# EAGLE design sabotter (EAGLE 6.5.0)
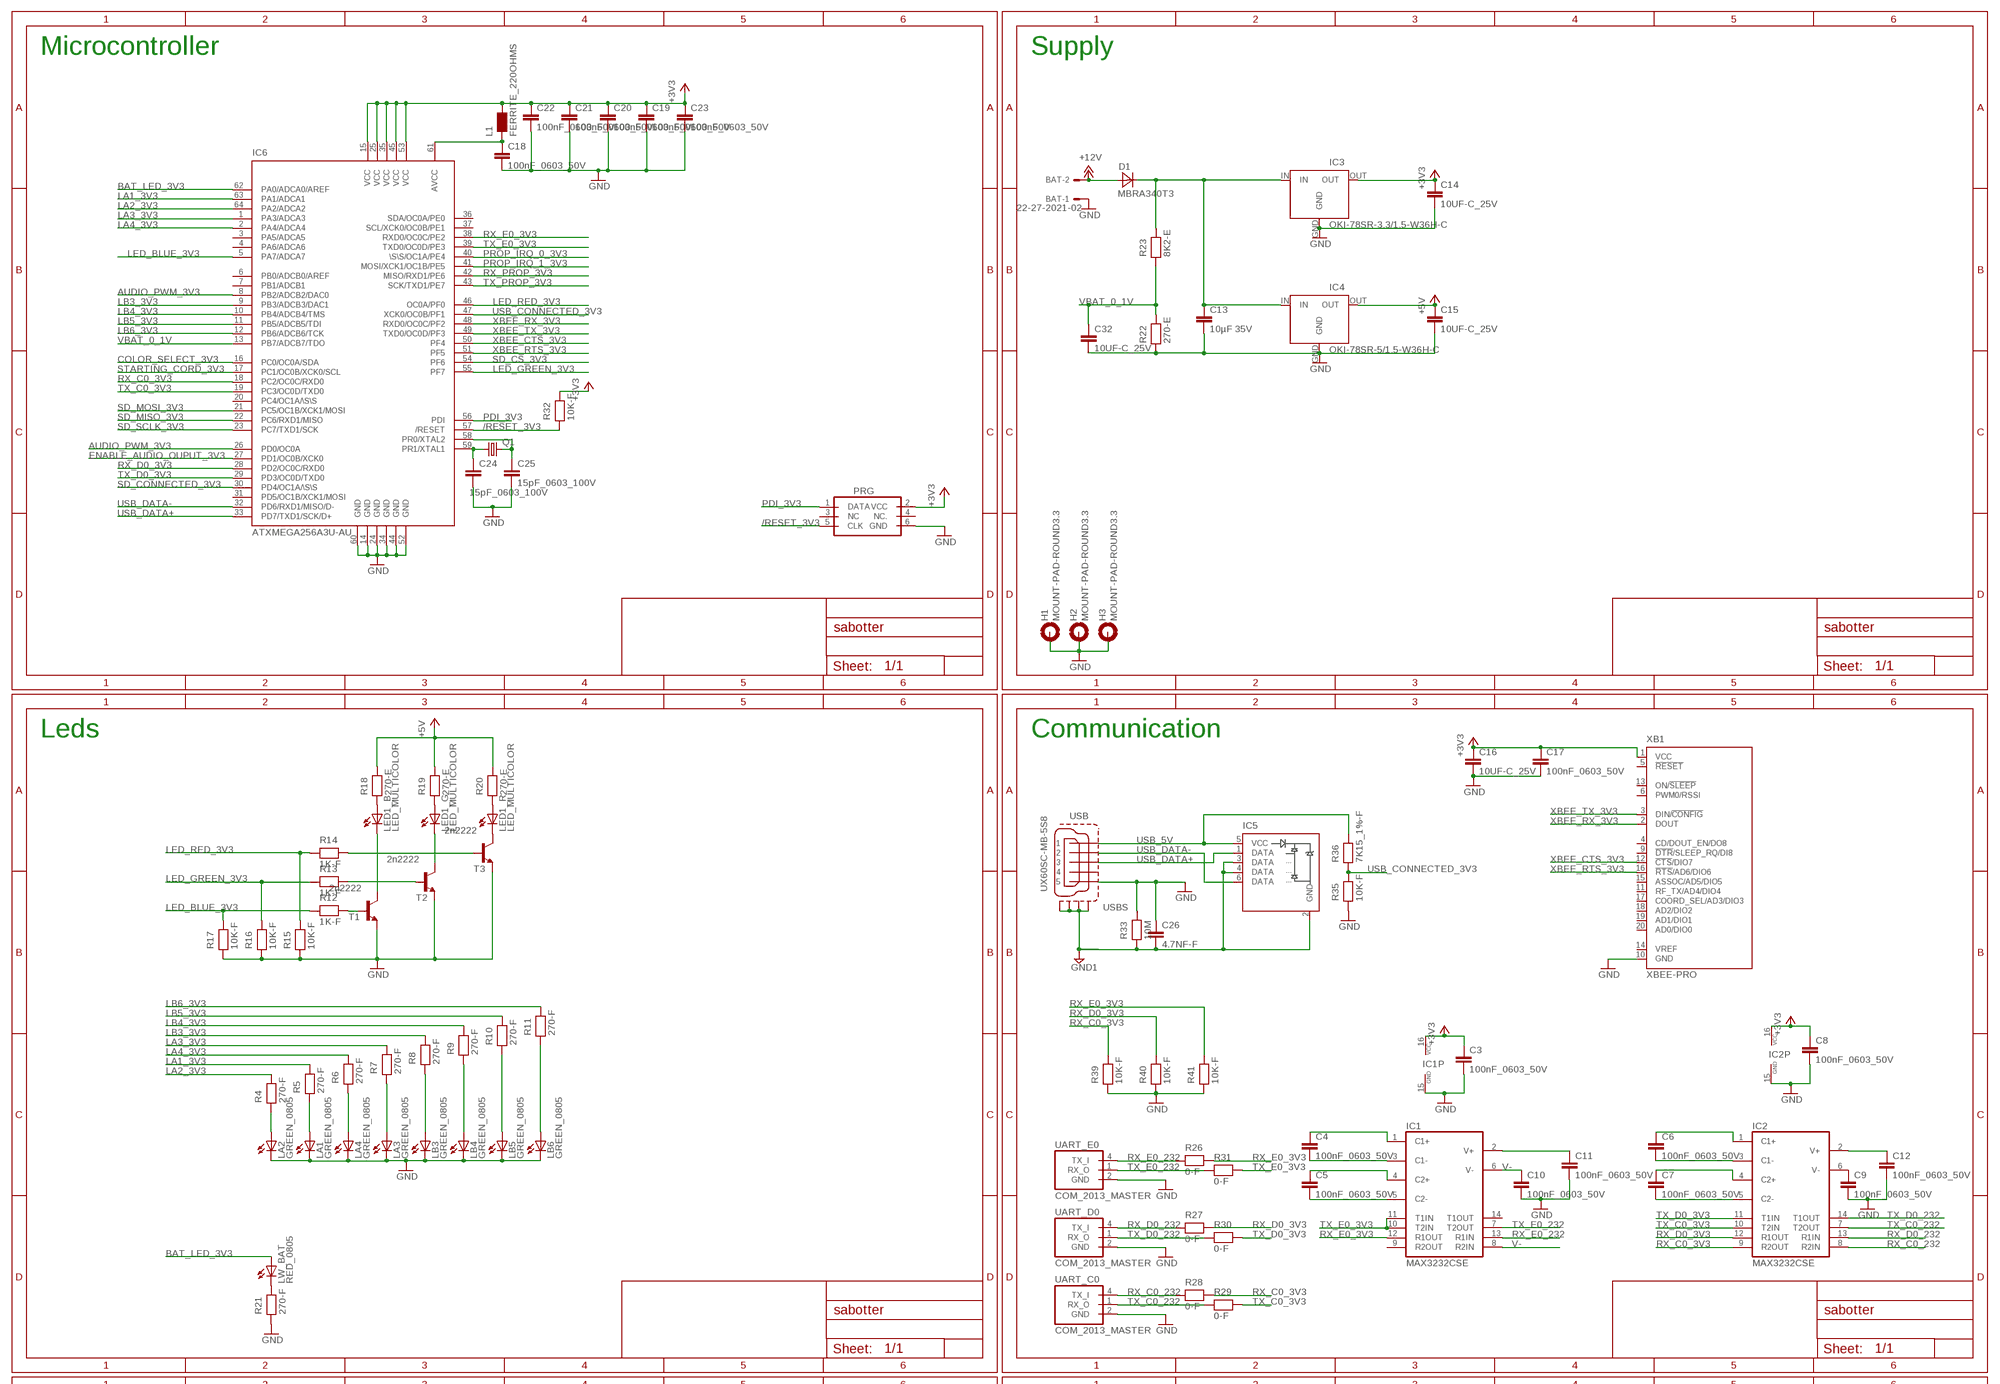
[diagram p0: schematic, sheet 1, part 1 of 2]
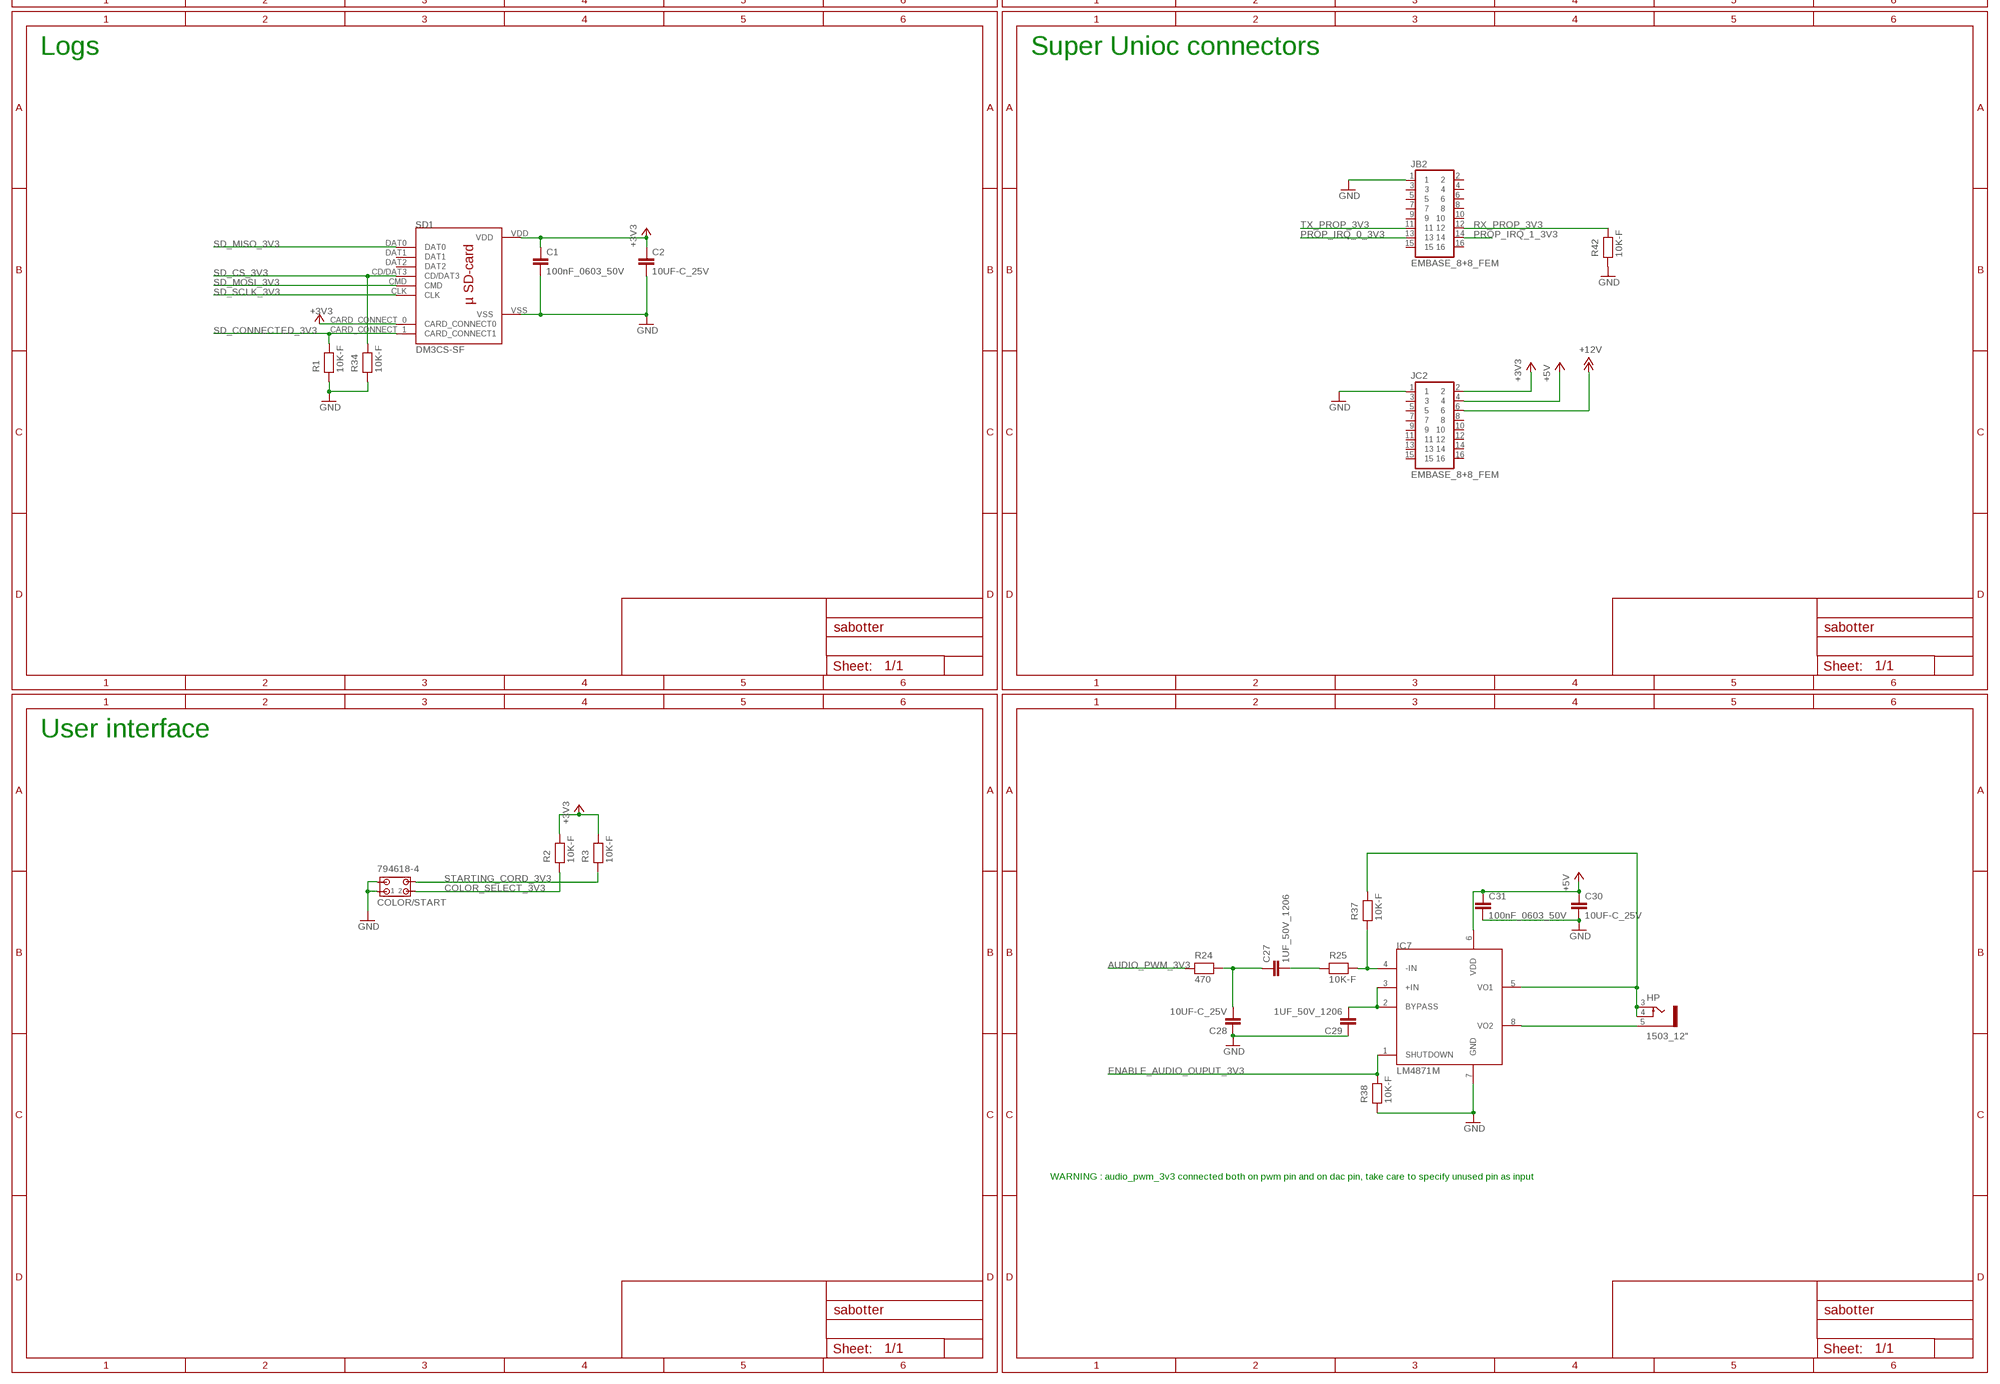
[diagram p1: schematic, sheet 1, part 2 of 2]

## Parts
BAT  22-27-2021-02  [6410-02]
C1  100nF_0603_50V  100NF-F  [C0603]
C2  10UF-C_25V  [C1210]
C3  100nF_0603_50V  100NF-F  [C0603]
C4  100nF_0603_50V  100NF-F  [C0603]
C5  100nF_0603_50V  100NF-F  [C0603]
C6  100nF_0603_50V  100NF-F  [C0603]
C7  100nF_0603_50V  100NF-F  [C0603]
C8  100nF_0603_50V  100NF-F  [C0603]
C9  100nF_0603_50V  100NF-F  [C0603]
C10  100nF_0603_50V  100NF-F  [C0603]
C11  100nF_0603_50V  100NF-F  [C0603]
C12  100nF_0603_50V  100NF-F  [C0603]
C13  10µF 35V  10UF-C_35V  [C1210]
C14  10UF-C_25V  [C1210]
C15  10UF-C_25V  [C1210]
C16  10UF-C_25V  [C1210]
C17  100nF_0603_50V  100NF-F  [C0603]
C18  100nF_0603_50V  100NF-F  [C0603]
C19  100nF_0603_50V  100NF-F  [C0603]
C20  100nF_0603_50V  100NF-F  [C0603]
C21  100nF_0603_50V  100NF-F  [C0603]
C22  100nF_0603_50V  100NF-F  [C0603]
C23  100nF_0603_50V  100NF-F  [C0603]
C24  15pF_0603_100V  15PF-F  [C0603]
C25  15pF_0603_100V  15PF-F  [C0603]
C26  4.7NF-F  [C0603]
C27  1UF_50V_1206  1UFD_25V  [C1206]
C28  10UF-C_25V  [C1210]
C29  1UF_50V_1206  1UFD_25V  [C1206]
C30  10UF-C_25V  [C1210]
C31  100nF_0603_50V  100NF-F  [C0603]
C32  10UF-C_25V  [C1210]
COLOR/START  794618-4  [794618-4]
D1  MBRA340T3  [SMA]
H1  MOUNT-PAD-ROUND3.3  [3,3-PAD]
H2  MOUNT-PAD-ROUND3.3  [3,3-PAD]
H3  MOUNT-PAD-ROUND3.3  [3,3-PAD]
HP  1503_12"  [1503_12]
IC1  MAX3232CSE  [SO16]
IC2  MAX3232CSE  [SO16]
IC3  OKI-78SR-3.3/1.5-W36H-C  [OKI78SR-HORIZONTAL]
IC4  OKI-78SR-5/1.5-W36H-C  [OKI78SR-HORIZONTAL]
IC5  LXES2SBAA4-016  [LXES2BAA4]
IC6  ATXMEGA256A3U-AU  [TQFP64]
IC7  LM4871M  [SO8]
JB2  EMBASE_8+8_FEM  [EMBASE_8+8_FEM]
JC2  EMBASE_8+8_FEM  [EMBASE_8+8_FEM]
L1  FERRITE_220OHMS  [R0603]
LA1  GREEN_0805  LED_G  [CHIP-LED0805]
LA2  GREEN_0805  LED_G  [CHIP-LED0805]
LA3  GREEN_0805  LED_G  [CHIP-LED0805]
LA4  GREEN_0805  LED_G  [CHIP-LED0805]
LB3  GREEN_0805  LED_G  [CHIP-LED0805]
LB4  GREEN_0805  LED_G  [CHIP-LED0805]
LB5  GREEN_0805  LED_G  [CHIP-LED0805]
LB6  GREEN_0805  LED_G  [CHIP-LED0805]
LED1  LED_MULTICOLOR  [PLCC6]
LW_BAT  RED_0805  LED_R  [CHIP-LED0805]
PRG  PDI_ATMELL  [ML6L]
Q1  CRYSTAL_16MHZ_HC49UP  [HC49UP]
R1  10K-F  [R0603]
R2  10K-F  [R0603]
R3  10K-F  [R0603]
R4  270-F  [R0603]
R5  270-F  [R0603]
R6  270-F  [R0603]
R7  270-F  [R0603]
R8  270-F  [R0603]
R9  270-F  [R0603]
R10  270-F  [R0603]
R11  270-F  [R0603]
R12  1K-F  [R0603]
R13  1K-F  [R0603]
R14  1K-F  [R0603]
R15  10K-F  [R0603]
R16  10K-F  [R0603]
R17  10K-F  [R0603]
R18  270-E  [R0805]
R19  270-E  [R0805]
R20  270-E  [R0805]
R21  270-F  [R0603]
R22  270-E  [R0805]
R23  8K2-E  [R0805]
R24  470  470-F  [R0603]
R25  10K-F  [R0603]
R26  0-F  [R0603]
R27  0-F  [R0603]
R28  0-F  [R0603]
R29  0-F  [R0603]
R30  0-F  [R0603]
R31  0-F  [R0603]
R32  10K-F  [R0603]
R33  10M  1M-F  [R0603]
R34  10K-F  [R0603]
R35  10K-F  [R0603]
R36  7K15_1%-F  [R0603]
R37  10K-F  [R0603]
R38  10K-F  [R0603]
R39  10K-F  [R0603]
R40  10K-F  [R0603]
R41  10K-F  [R0603]
R42  10K-F  [R0603]
SD1  DM3CS-SF  [DM3CS-SF]
T1  2n2222  MMBT2222ALT1-NPN-SOT23-BEC  [SOT23-BEC]
T2  2n2222  MMBT2222ALT1-NPN-SOT23-BEC  [SOT23-BEC]
T3  2n2222  MMBT2222ALT1-NPN-SOT23-BEC  [SOT23-BEC]
UART_C0  COM_2013_MASTER  [MICROMATCH-4_SMD]
UART_D0  COM_2013_MASTER  [MICROMATCH-4_SMD]
UART_E0  COM_2013_MASTER  [MICROMATCH-4_SMD]
USB  UX60SC-MB-5S8  MINI-USB-SHIELD-UX60-MB-5S8  [UX60-MB-5S8]
XB1  XBEE-PRO  [XBEE-PRO]

## Nets
+3V3: C1.1 C2.1 C3.1 C8.1 C14.1 C16.1 C17.1 C19.1 C20.1 C21.1 C22.1 C23.1 IC1.16(VCC) IC2.16(VCC) IC3.OUT IC6.15(VCC) IC6.25(VCC) IC6.35(VCC) IC6.45(VCC) IC6.53(VCC) JC2.2 L1.2 PRG.2(VCC) R2.2 R3.2 R32.2 SD1.CARD_CONNECT_0(CARD_CONNECT0) SD1.VDD XB1.1(VCC)
+5V: C15.1 C30.1 C31.1 IC4.OUT IC7.6(VDD) JC2.4 R18.2 R19.2 R20.2
+12V: BAT.2 D1.A JC2.6
/RESET_3V3: IC6.57(/RESET) PRG.5(CLK) R32.1
AUDIO_PWM_3V3: IC6.8(PB2/ADCB2/DAC0) IC6.26(PD0/OC0A) R24.1
BAT_LED_3V3: IC6.62(PA0/ADCA0/AREF) LW_BAT.A
COLOR_SELECT_3V3: COLOR/START.2 IC6.16(PC0/OC0A/SDA) R2.1
ENABLE_AUDIO_OUPUT_3V3: IC6.27(PD1/OC0B/XCK0) IC7.1(SHUTDOWN) R38.2
GND: BAT.1 C1.2 C2.2 C3.2 C8.2 C9.2 C10.2 C11.2 C12.2 C13.2 C14.2 C15.2 C16.2 C17.2 C18.2 C19.2 C20.2 C21.2 C22.2 C23.2 C24.2 C25.2 C26.1 C28.1 C29.1 C30.2 C31.2 C32.2 COLOR/START.1 COLOR/START.3 H1.B3,3(MOUNT) H2.B3,3(MOUNT) H3.B3,3(MOUNT) IC1.15(GND) IC2.15(GND) IC3.GND IC4.GND IC6.14(GND) IC6.24(GND) IC6.34(GND) IC6.44(GND) IC6.52(GND) IC6.60(GND) IC7.7(GND) JB2.1 JC2.1 LA1.C LA2.C LA3.C LA4.C LB3.C LB4.C LB5.C LB6.C PRG.6(GND) R1.1 R15.1 R16.1 R17.1 R21.1 R22.1 R33.2 R34.1 R35.1 R38.1 R39.1 R40.1 R41.1 R42.1 SD1.VSS T1.E T2.E T3.E UART_C0.2(GND) UART_D0.2(GND) UART_E0.2(GND) USB.5 XB1.10(GND)
GND1: C26.2 IC5.2(GND) IC5.3(DATA) IC5.4(DATA) R33.1 USB.M1(S1) USB.M2(S2) USB.M3(S3) USB.M4(S4)
LA1_3V3: IC6.63(PA1/ADCA1) R5.2
LA2_3V3: IC6.64(PA2/ADCA2) R4.2
LA3_3V3: IC6.1(PA3/ADCA3) R7.2
LA4_3V3: IC6.2(PA4/ADCA4) R6.2
LB3_3V3: IC6.9(PB3/ADCB3/DAC1) R8.2
LB4_3V3: IC6.10(PB4/ADCB4/TMS) R9.2
LB5_3V3: IC6.11(PB5/ADCB5/TDI) R10.2
LB6_3V3: IC6.12(PB6/ADCB6/TCK) R11.2
LED_BLUE_3V3: IC6.5(PA7/ADCA7) R12.1 R17.2
LED_GREEN_3V3: IC6.55(PF7) R13.1 R16.2
LED_RED_3V3: IC6.46(OC0A/PF0) R14.1 R15.2
N$1: LA2.A R4.1
N$2: LA1.A R5.1
N$3: LB3.A R8.1
N$4: LA3.A R7.1
N$5: LB4.A R9.1
N$6: LB5.A R10.1
N$7: LB6.A R11.1
N$8: LA4.A R6.1
N$9: HP.5 IC7.8(VO2)
N$15: C29.2 IC7.2(BYPASS) IC7.3(+IN)
N$18: C9.1 IC2.6(V-)
N$20: C27.1 C28.2 R24.2
N$22: LED1.3(_R:C) T3.C
N$23: LED1.2(_G:C) T2.C
N$24: LED1.1(_B:C) T1.C
N$25: C12.1 IC2.2(V+)
N$26: C11.1 IC1.2(V+)
N$27: R14.2 T3.B
N$28: C4.1 IC1.1(C1+)
N$29: C6.1 IC2.1(C1+)
N$30: C5.1 IC1.4(C2+)
N$31: C5.2 IC1.5(C2-)
N$32: C4.2 IC1.3(C1-)
N$33: C6.2 IC2.3(C1-)
N$34: C7.1 IC2.4(C2+)
N$35: C7.2 IC2.5(C2-)
N$36: C27.2 R25.1
N$37: IC7.4(-IN) R25.2 R37.1
N$38: HP.3 HP.4 IC7.5(VO1) R37.2
N$52: R13.2 T2.B
N$53: R12.2 T1.B
N$57: LED1.6(_B:A) R18.1
N$58: LED1.5(_G:A) R19.1
N$59: LED1.4(_R:A) R20.1
N$60: LW_BAT.C R21.2
N$62: C13.1 D1.C IC3.IN IC4.IN R23.2
N$71: C18.1 IC6.61(AVCC) L1.1
N$75: C24.1 IC6.59(PR1/XTAL1) Q1.1
N$76: C25.1 IC6.58(PR0/XTAL2) Q1.2
PDI_3V3: IC6.56(PDI) PRG.1(DATA)
PROP_IRQ_0_3V3: IC6.40(\S\S/OC1A/PE4) JB2.13
PROP_IRQ_1_3V3: IC6.41(MOSI/XCK1/OC1B/PE5) JB2.14
RX_C0_3V3: IC2.9(R2OUT) IC6.18(PC2/OC0C/RXD0) R28.2 R39.2
RX_C0_232: IC2.8(R2IN) R28.1 UART_C0.4(TX_I)
RX_D0_3V3: IC2.12(R1OUT) IC6.28(PD2/OC0C/RXD0) R27.2 R40.2
RX_D0_232: IC2.13(R1IN) R27.1 UART_D0.4(TX_I)
RX_E0_3V3: IC1.12(R1OUT) IC6.38(RXD0/OC0C/PE2) R26.2 R41.2
RX_E0_232: IC1.13(R1IN) R26.1 UART_E0.4(TX_I)
RX_PROP_3V3: IC6.42(MISO/RXD1/PE6) JB2.12 R42.2
SD_CONNECTED_3V3: IC6.30(PD4/OC1A/\S\S) R1.2 SD1.CARD_CONNECT_1(CARD_CONNECT1)
SD_CS_3V3: IC6.54(PF6) R34.2 SD1.CD/DAT3
SD_MISO_3V3: IC6.22(PC6/RXD1/MISO) SD1.DAT0
SD_MOSI_3V3: IC6.21(PC5/OC1B/XCK1/MOSI) SD1.CMD
SD_SCLK_3V3: IC6.23(PC7/TXD1/SCK) SD1.CLK
STARTING_CORD_3V3: COLOR/START.4 IC6.17(PC1/OC0B/XCK0/SCL) R3.1
TX_C0_3V3: IC2.10(T2IN) IC6.19(PC3/OC0D/TXD0) R29.2
TX_C0_232: IC2.7(T2OUT) R29.1 UART_C0.1(RX_O)
TX_D0_3V3: IC2.11(T1IN) IC6.29(PD3/OC0D/TXD0) R30.2
TX_D0_232: IC2.14(T1OUT) R30.1 UART_D0.1(RX_O)
TX_E0_3V3: IC1.10(T2IN) IC1.11(T1IN) IC6.39(TXD0/OC0D/PE3) R31.2
TX_E0_232: IC1.7(T2OUT) R31.1 UART_E0.1(RX_O)
TX_PROP_3V3: IC6.43(SCK/TXD1/PE7) JB2.11
USB_5V: IC5.5(VCC) R36.2 USB.1
USB_CONNECTED_3V3: IC6.47(XCK0/OC0B/PF1) R35.2 R36.1
USB_DATA+: IC5.1(DATA) IC6.33(PD7/TXD1/SCK/D+) USB.3
USB_DATA-: IC5.6(DATA) IC6.32(PD6/RXD1/MISO/D-) USB.2
V-: C10.1 IC1.6(V-) IC1.8(R2IN)
VBAT_0_1V: C32.1 IC6.13(PB7/ADCB7/TDO) R22.2 R23.1
XBEE_CTS_3V3: IC6.50(PF4) XB1.12(!CTS!/DIO7)
XBEE_RTS_3V3: IC6.51(PF5) XB1.16(!RTS!/AD6/DIO6)
XBEE_RX_3V3: IC6.48(RXD0/OC0C/PF2) XB1.2(DOUT)
XBEE_TX_3V3: IC6.49(TXD0/OC0D/PF3) XB1.3(DIN/!CONFIG)
Unconnected: IC1.9(R2OUT) IC1.14(T1OUT) IC6.3(PA5/ADCA5) IC6.4(PA6/ADCA6) IC6.6(PB0/ADCB0/AREF) IC6.7(PB1/ADCB1) IC6.20(PC4/OC1A/\S\S) IC6.31(PD5/OC1B/XCK1/MOSI) IC6.36(SDA/OC0A/PE0) IC6.37(SCL/XCK0/OC0B/PE1) JB2.2 JB2.3 JB2.4 JB2.5 JB2.6 JB2.7 JB2.8 JB2.9 JB2.10 JB2.15 JB2.16 JC2.3 JC2.5 JC2.7 JC2.8 JC2.9 JC2.10 JC2.11 JC2.12 JC2.13 JC2.14 JC2.15 JC2.16 PRG.3(NC) PRG.4(NC.) SD1.DAT1 SD1.DAT2 USB.4 XB1.4(CD/DOUT_EN/DO8) XB1.5(!RESET) XB1.6(PWM0/RSSI) XB1.9(!DTR!/SLEEP_RQ/DI8) XB1.11(RF_TX/AD4/DIO4) XB1.13(ON/!SLEEP) XB1.14(VREF) XB1.15(ASSOC/AD5/DIO5) XB1.17(COORD_SEL/AD3/DIO3) XB1.18(AD2/DIO2) XB1.19(AD1/DIO1) XB1.20(AD0/DIO0)

## Notes on the sheet
- Microcontroller | Supply
- Leds | Communication
- Logs | Super Unioc connectors
- User interface
- WARNING : audio_pwm_3v3 connected both on pwm pin and on dac pin, take care to specify unused pin as input

## Library data of the parts
BAT = robotter_connector:22-?-02: CONNECTOR wire to board 2.54 mm (.1 inch) pitch header; MOUSER: 538-22-27-2021; RS: 483-8461
C1 C3-C12 C17-C23 C31 = robotter_capacitor:100NF; MOUSER: 81-GRM188F51H104ZA01; RS: 723-5534; VALUE: 100nF 50V
C2 C14-C16 C28 C30 C32 = robotter_capacitor:10UF; MOUSER: 963-TMK316BJ106KL-T; RS: 766-1185; VALUE: 10µF 25V
C13 = robotter_capacitor:10UF; MOUSER: 963-GMK325BJ106MN-T; RS: 758-3325
C24 C25 = robotter_capacitor:15PF; MOUSER: 581-06031A150K4T2A; RS: 147-421
C26 = robotter_capacitor:4.7NF; MOUSER: 81-GCM188R71H472K37D; RS: 723-5004; VALUE: 4.7nF 50V
C27 C29 = robotter_capacitor:1UF; MOUSER: 810-C3216X7R1E105K-6; RS: 740-7574; VALUE: 1µF 25V
COLOR/START = robotter_connector:794618-4; MOUSER: 571-3-794618-4; RS: 495-9439
D1 = robotter_diode:MBRA340T3: Surface Mount Schottky Power Rectifier Source: http://www.onsemi.com/pub_link/Collateral/MBRA340T3-D.PDF; MOUSER: 863-MBRA340T3G; RS: 688-0502
H1-H3 = holes:MOUNT-PAD-ROUND: MOUNTING PAD, round
HP = robotter_connector:1503_12: Jack connectors according to JISC 6560, 2.5mm / 3.5 mm Klinkensteckverbinder nach JISC 6560, 2.5mm / 3,5 mm Source: http://www.lumberg.com/Produkte/PDFs/KLBR2.pdf www.lumberg.com/Produkte/PDFs/KLBR1.pdf; FARNELL: 1340604; MPN: 1503 12; RS: 413-453; VALUE: 1503 12
IC1 IC2 = robotter_ic:MAX3232: True RS-232 Transceivers 3.0V to 5.5V, Low-Power up to 1Mbps, Using Four 0.1µF External Capacitors Source: http://pdfserv.maxim-ic.com/en/ds/MAX3222-MAX3241.pdf; MOUSER: 511-ST3232CDR; RS: 415-2105
IC3 = robotter_ic:OKI-78SR: 1.5A, 7-36V DC regulator; MOUSER: 580-OKI78SR3.31.5WHC
IC4 = robotter_ic:OKI-78SR: 1.5A, 7-36V DC regulator; MOUSER: 580-OKI78SR51.5W36HC
IC5 = robotter_ic:LXES2SBAA4-016; MOUSER: 81-LXES2SBAA4-016
IC6 = robotter_ic:ATXMEGA256A3U; FARNELL: 2066307; MOUSER: 556-ATXMEGA256A3U-AU
IC7 = robotter_ic:LM4871; MOUSER: 926-LM4871MX/NOPB; RS: 533-8271
JB2 JC2 = robotter_connector:EMBASE_8+8_FEM; FARNELL: 1109794; MOUSER: 855-M22-7140842; RS: 605-8847
L1 = robotter_inductor:FERRITE_220OHMS; MOUSER: 81-BLM18BB221SN1D; RS: 724-1302; VALUE: 220 ohms
LA1-LA4 LB3-LB6 = robotter_diode:LED_; MOUSER: 859-LTST-C171GKT; RS: 692-0935; VALUE: GREEN
LED1 = robotter_diode:LED_MULTICOLOR; FARNELL: 1863245; MANUFACTURER: AVAGO TECHNOLOGIES; MOUSER: 630-ASMT-YTD2-0BB02; RS: 769-3520; VALUE: ASMT-YTD2-0BB02
LW_BAT = robotter_diode:LED_; MOUSER: 859-LTST-C171EKT; RS: 692-0931; VALUE: RED
PRG = robotter_connector:PDI_ATMEL: Ref Harting : 09 18 506 7323 Atmel pdi connector; MOUSER: 617-09-18-506-7323; RS: 693-5242
Q1 = robotter_ic:CRYSTAL_: CRYSTAL; MOUSER: 559-FOXSD160-20-LF; RS: 547-6531; VALUE: 16 MHz
R1-R3 R15-R17 R25 R32 R34 R35 R37-R42 = robotter_resistor:10K; MOUSER: 652-CR0603-JW-103ELF; RS: 740-8899
R4-R11 R21 = robotter_resistor:270; MOUSER: 71-CRCW0603J-270-E3; RS: 679-0071
R12-R14 = robotter_resistor:1K; MOUSER: 71-CRCW0603-1.0K-E3; RS: 213-2266; VALUE: 1k
R18-R20 R22 = robotter_resistor:270; MOUSER: 652-CR0805-FX2700GLF; RS: 740-9019
R23 = robotter_resistor:8K2; MOUSER: 71-CRCW08058K20FKEB; RS: 679-1727
R24 = robotter_resistor:470; MOUSER: 279-CRG0603F470R; RS: 213-2222
R26-R31 = robotter_resistor:0
R33 = robotter_resistor:1M
R36 = robotter_resistor:7K15_1%; MOUSER: 71-CRCW0603-7.15K-E3; RS: 679-0709
SD1 = robotter_connector:DM3CS-SF; MOUSER: 798-DM3CSSF; RS: 772-6787
T1-T3 = robotter_ic:*-NPN-: NPN Transistror; MOUSER: 863-MMBT2222ALT1G; RS: 544-9400; VALUE: mmbt2222
UART_C0 UART_D0 UART_E0 = robotter_connector:COM_2013_MASTER; MOUSER: 571-7-188275-4; RS: 366-1721
USB = robotter_connector:MINI-USB-SHIELD-: MINI USB Connector Source: http://www.hirose.co.jp/cataloge_hp/e24000019.pdf; MOUSER: 798-UX60SCMB5S880; OC_FARNELL: unknown; OC_NEWARK: unknown; RS: 772-6926
XB1 = maxstream:XBEE: XBee (TM) /XBee-PRO(TM) OEM RF Modules Source: MaxStream, Inc. xbee_productmanual.pdf; MPN: XBP24-AWI-001; OC_FARNELL: 1337916; OC_NEWARK: 42M2667

## Board
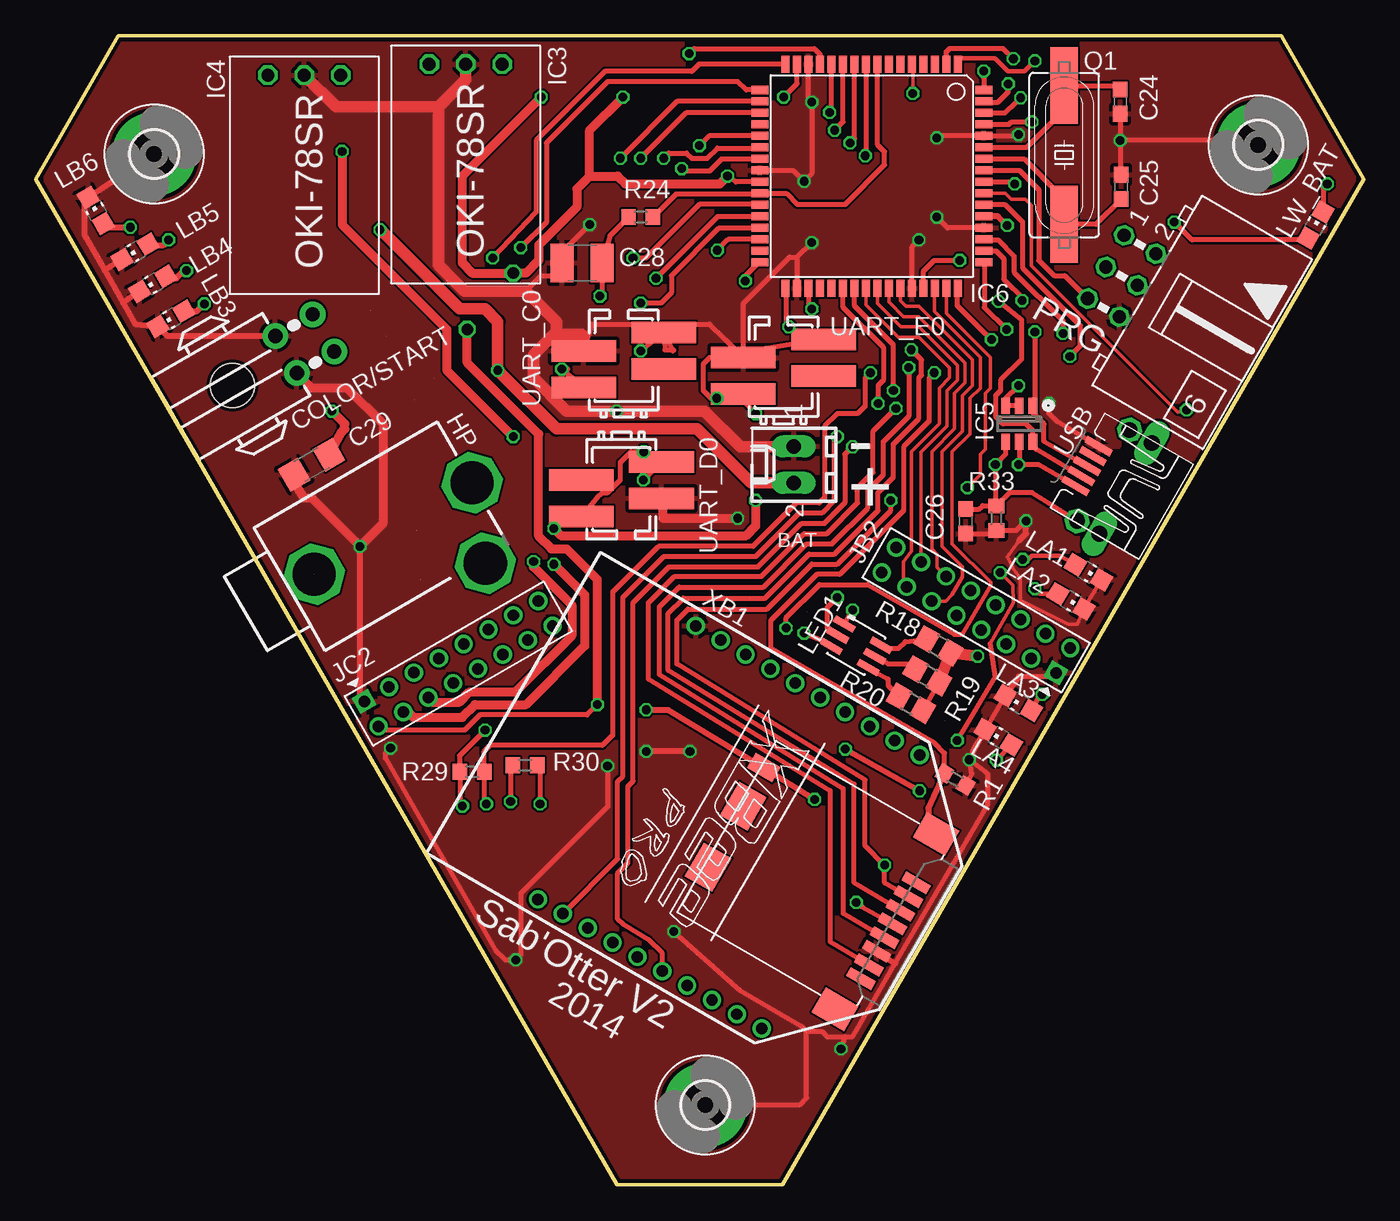
[diagram p2: board, top side]
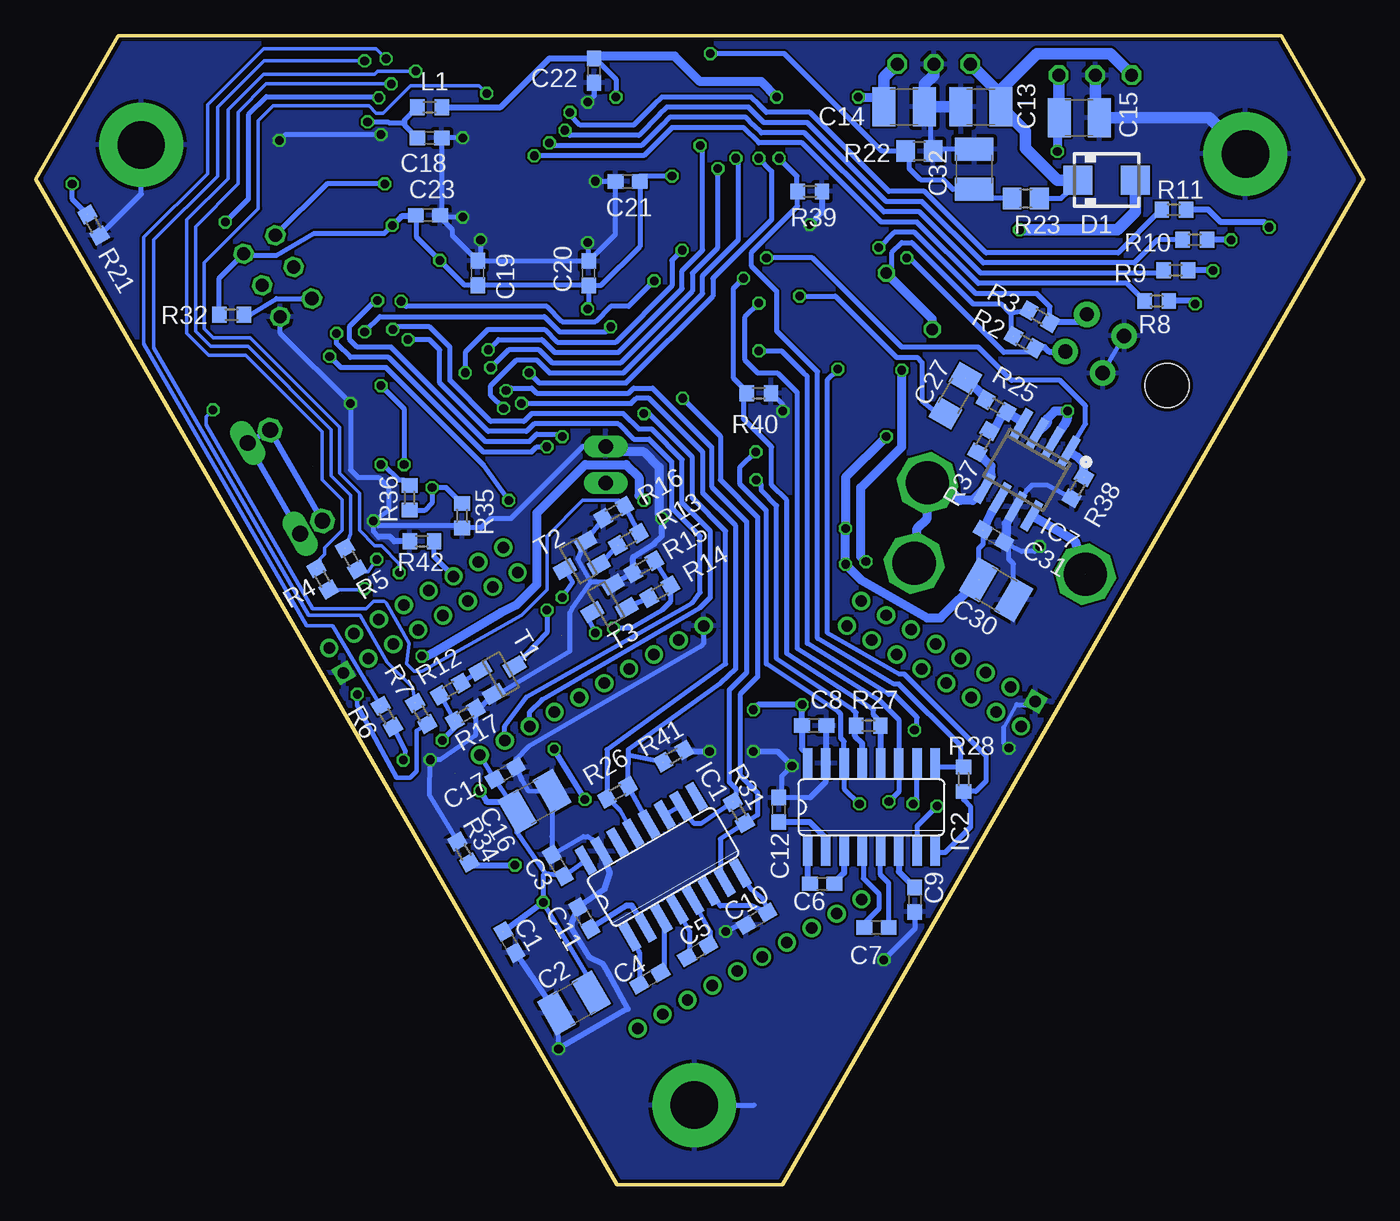
[diagram p3: board, bottom side, seen from below]

Size 92.5 x 80 mm. Coordinates in mm from the lower left corner, seen from the top.
Outline: 5.75,80 86.75,80 92.5,70 52,0 40.5,0 0,70 5.75,80
Copper layers (1*16): Top 0.035mm / dielectric 1.6mm / Bottom 0.035mm
Design rules "SeeedStudio_DRU_no_angle_20130527 *": minimum track width 6mil, minimum drill 12mil, track to track 6mil, track to pad 6mil, pad to pad 6mil, via to via 6mil, smd to smd 0mil, copper to edge 10mil, drill to drill 10mil, minimum pad ring 6mil, minimum via ring 6mil, stop-mask expansion 2mil, vias tented up to drill 25mil, thermal gap 10mil

### Footprints (pad centres in the part's own frame; a part is rotated, then mirrored left to right if it is on the bottom)
6410-02 = drill 1.016 long: 1 1.27,0; 2 -1.27,0
C0603 = smd 1.1 x 1: 1 -0.85,0; 2 0.85,0
C1210 = smd 1.6 x 2.7: 1 -1.4,0; 2 1.4,0
C1206 = smd 1.6 x 1.8: 1 -1.4,0; 2 1.4,0
794618-4 = drill 1 pad 1.778: 1 1.5,4.32; 2 1.5,7.32; 3 -1.5,4.32; 4 -1.5,7.32 | hole 3.1: 0,0
SMA = smd 2 x 2: A 2,0; C -2,0
3,3-PAD = drill 3.3 pad 5.842: B3,3 0,0
1503_12 = drill 3 pad 4 octagon: 3 0,-6.35; 4 -5.3,-4.35; 5 0,6.35
SO16 = smd 0.66 x 2.032: 1 -4.445,-3.073; 2 -3.175,-3.073; 3 -1.905,-3.073; 4 -0.635,-3.073; 5 0.635,-3.073; 6 1.905,-3.073; 7 3.175,-3.073; 8 4.445,-3.073; 9 4.445,3.073; 10 3.175,3.073; 11 1.905,3.073; 12 0.635,3.073; 13 -0.635,3.073; 14 -1.905,3.073; 15 -3.175,3.073; 16 -4.445,3.073
OKI78SR-HORIZONTAL = drill 0.9 octagon: GND 0,0; IN 2.54,0; OUT -2.54,0
LXES2BAA4 = smd 0.6 x 1.1: 1 -0.95,-1.25; 2 0,-1.25; 3 0.95,-1.25; 4 0.95,1.25; 5 0,1.25; 6 -0.95,1.25
TQFP64 = smd 1.194 x 0.559: 1 -7.8,6; 2 -7.8,5.2; 3 -7.8,4.4; 4 -7.8,3.6; 5 -7.8,2.8; 6 -7.8,2; 7 -7.8,1.2; 8 -7.8,0.4; 9 -7.8,-0.4; 10 -7.8,-1.2; 11 -7.8,-2; 12 -7.8,-2.8; 13 -7.8,-3.6; 14 -7.8,-4.4; 15 -7.8,-5.2; 16 -7.8,-6; 33 7.8,-6; 34 7.8,-5.2; 35 7.8,-4.4; 36 7.8,-3.6; 37 7.8,-2.8; 38 7.8,-2; 39 7.8,-1.2; 40 7.8,-0.4; 41 7.8,0.4; 42 7.8,1.2; 43 7.8,2; 44 7.8,2.8; 45 7.8,3.6; 46 7.8,4.4; 47 7.8,5.2; 48 7.8,6 | smd 0.559 x 1.194: 17 -6,-7.8; 18 -5.2,-7.8; 19 -4.4,-7.8; 20 -3.6,-7.8; 21 -2.8,-7.8; 22 -2,-7.8; 23 -1.2,-7.8; 24 -0.4,-7.8; 25 0.4,-7.8; 26 1.2,-7.8; 27 2,-7.8; 28 2.8,-7.8; 29 3.6,-7.8; 30 4.4,-7.8; 31 5.2,-7.8; 32 6,-7.8; 49 6,7.8; 50 5.2,7.8; 51 4.4,7.8; 52 3.6,7.8; 53 2.8,7.8; 54 2,7.8; 55 1.2,7.8; 56 0.4,7.8; 57 -0.4,7.8; 58 -1.2,7.8; 59 -2,7.8; 60 -2.8,7.8; 61 -3.6,7.8; 62 -4.4,7.8; 63 -5.2,7.8; 64 -6,7.8
SO8 = smd 0.6 x 2.2: 1 -1.905,-2.6; 2 -0.635,-2.6; 3 0.635,-2.6; 4 1.905,-2.6; 5 1.905,2.6; 6 0.635,2.6; 7 -0.635,2.6; 8 -1.905,2.6
EMBASE_8+8_FEM = drill 0.8 pad 1.27 square: 1 -7,1 | drill 0.8 pad 1.27: 2 -7,-1; 3 -5,1; 4 -5,-1; 5 -3,1; 6 -3,-1; 7 -1,1; 8 -1,-1; 9 1,1; 10 1,-1; 11 3,1; 12 3,-1; 13 5,1; 14 5,-1; 15 7,1; 16 7,-1
R0603 = smd 1 x 1.1: 1 -0.85,0; 2 0.85,0
CHIP-LED0805 = smd 1.2 x 1.2: A 0,-1.05; C 0,1.05
PLCC6 = smd 1.6 x 0.5: 1 1.475,-0.9; 2 1.475,0; 3 1.475,0.9; 4 -1.475,0.9; 5 -1.475,0; 6 -1.475,-0.9
ML6L = drill 0.914 octagon: 1 -2.54,-1.27; 2 -2.54,1.27; 3 0,-1.27; 4 0,1.27; 5 2.54,-1.27; 6 2.54,1.27
HC49UP = smd 5.334 x 1.93: 1 -4.826,0; 2 4.826,0
R0805 = smd 1.3 x 1.5: 1 -0.95,0; 2 0.95,0
DM3CS-SF = smd 1.2 x 2: CARD_CONNECT_0 -4.85,0.2 | smd 2 x 2.6: CARD_CONNECT_1 -6.85,12.9; GND0 7.25,12.9 | smd 0.7 x 2: CD/DAT3 -2.1,13.4; CLK 1.2,13.4; CMD -1,13.4; DAT0 3.4,13.4; DAT1 4.5,13.4; DAT2 -3.2,13.4; VDD 0.1,13.4; VSS 2.3,13.4 | smd 2.7 x 2.2: GND1 -1.8,0.3; GND2 3.1,0.3
SOT23-BEC = smd 1 x 1.4: B -0.95,-1.1; C 0,1.1; E 0.95,-1.1
MICROMATCH-4_SMD = smd 1.5 x 4.5: 1 1.905,-2.794; 2 0.635,2.794; 3 -0.635,-2.794; 4 -1.905,2.794
UX60-MB-5S8 = smd 2 x 0.5: 1 6.4,1.6; 2 6.4,0.8; 3 6.4,0; 4 6.4,-0.8; 5 6.4,-1.6 | drill 1.1 long: M1 3.3,-3.65; M2 3.3,3.65 | drill 1.1 octagon: M3 5.1,3.65; M4 5.1,-3.65
XBEE-PRO = drill 0.8 pad 1.27: 1 -11,9; 2 -11,7; 3 -11,5; 4 -11,3; 5 -11,1; 6 -11,-1; 7 -11,-3; 8 -11,-5; 9 -11,-7; 10 -11,-9; 11 11,-9; 12 11,-7; 13 11,-5; 14 11,-3; 15 11,-1; 16 11,1; 17 11,3; 18 11,5; 19 11,7; 20 11,9

### Placement (x,y rotation side)
BAT  52.81,50.14 90 top
C1  59.51,16.89 300 bottom
C2  55.02,12.65 210 bottom
C3  56.13,22.23 120 bottom
C4  49.73,14.35 30 bottom
C5  46.39,16.25 30 bottom
C6  37.72,20.95 0 bottom
C7  33.93,17.91 0 bottom
C8  38.28,31.97 0 bottom
C9  31.27,19.84 270 bottom
C10  42.28,18.52 210 bottom
C11  54.3,18.56 120 bottom
C12  40.74,26.11 90 bottom
C13  26.67,75.06 180 bottom
C14  32,75.06 0 bottom
C15  19.81,74.3 0 bottom
C16  57.75,26.68 30 bottom
C17  59.8,28.66 30 bottom
C18  65.07,72.9 0 bottom
C19  61.72,63.49 90 bottom
C20  53.99,63.47 90 bottom
C21  51.28,69.86 180 bottom
C22  53.61,77.58 270 bottom
C23  65.18,67.51 0 bottom
C24  75.55,75.42 270 top
C25  75.61,69.49 90 top
C26  64.79,46.2 90 top
C27  28.45,54.94 60 bottom
C28  38.05,64.19 0 top
C29  19.2,50.14 30 top
C30  25.6,41.43 330 bottom
C31  25.78,45.16 330 bottom
C32  27.13,70.71 90 bottom
COLOR/START  13.69,55.65 300 top
D1  17.91,69.95 0 bottom
H1  8.24,71.78 0 top
H2  46.63,5.54 0 top
H3  85.16,72.41 0 top
HP  24.89,45.69 120 top
IC1  48.8,22.13 30 bottom
IC2  34.29,26.29 0 bottom
IC3  29.94,78.03 180 top
IC4  18.7,77.27 180 top
IC5  68.51,52.99 180 top
IC6  58.23,70.23 270 top
IC7  23.47,49.78 150 bottom
JB2  65.5,40 150 top
JC2  29.43,36.29 30 top
L1  65.07,75.03 0 bottom
LA1  73.33,42.64 240 top
LA2  72.11,40.62 240 top
LA3  68.45,33.53 60 top
LA4  67.05,31.15 60 top
LB3  9.4,60.3 120 top
LB4  8.14,62.73 120 top
LB5  6.91,64.97 120 top
LB6  4.17,67.84 30 top
LED1  57.15,37.53 150 top
LW_BAT  89.16,66.84 330 top
PRG  75.64,63.27 240 top
Q1  71.64,71.71 270 top
R1  64.03,28.22 150 top
R2  23.65,58.67 150 bottom
R3  22.58,60.45 150 bottom
R4  72.53,42.19 120 bottom
R5  70.54,43.58 120 bottom
R6  68.05,32.61 120 bottom
R7  65.65,32.81 120 bottom
R8  14.42,61.54 180 bottom
R9  13.09,63.68 180 bottom
R10  11.76,65.81 180 bottom
R11  13.21,67.9 180 bottom
R12  63.62,34.5 30 bottom
R13  51.21,44.95 210 bottom
R14  49.03,41.29 210 bottom
R15  50.15,43.03 30 bottom
R16  52.23,46.84 30 bottom
R17  62.59,32.72 210 bottom
R18  62.89,37.52 330 top
R19  62.1,35.43 330 top
R20  60.96,33.53 330 top
R21  88.48,66.84 120 bottom
R22  30.95,71.97 180 bottom
R23  23.54,68.68 0 bottom
R24  42.14,67.39 180 top
R25  25.6,54.23 330 bottom
R26  51.98,27.32 30 bottom
R27  34.51,31.96 0 bottom
R28  27.86,28.23 90 bottom
R29  30.39,28.75 0 top
R30  34.07,29.2 180 top
R31  43.53,25.92 120 bottom
R32  78.87,60.58 180 bottom
R33  66.92,46.41 270 top
R34  62.71,23.16 300 bottom
R35  62.81,46.58 90 bottom
R36  66.47,47.83 90 bottom
R37  26.49,51.74 240 bottom
R38  19.91,48.54 60 bottom
R39  38.58,69.16 180 bottom
R40  42.14,55.12 180 bottom
R41  48.06,29.84 210 bottom
R42  65.61,44.81 0 bottom
SD1  48.12,24.94 240 top
T1  60.1,35.55 300 bottom
T2  54.7,43.43 120 bottom
T3  52.77,40.43 120 bottom
UART_C0  40.95,57.43 90 top
UART_D0  40.79,48.42 270 top
UART_E0  52.08,56.96 90 top
USB  78.78,46.84 150 top
XB1  48.27,24.89 240 top

### Tracks (layer width: path | path; a pad name or v marks a point on that pad's centre or on a via)
+3V3  (via drill 0.6, 0.8)  (3 unrouted)
  Top 0.356: JC2.2 24.14,31.65 29.87,31.65 30.94,32.72 38.41,32.72 v39.12,33.43 | IC6.25 48.76,69.83 v48.18,70.23 | 53.87,62.39 IC6.35 53.83,61.2 v54.05,60.98 | v52.09,75.74 53.03,76.68 IC6.15 | IC6.45 61.83,63.61 62.59,64.36 v64.36,64.36 | v57.15,19.66 57.56,19.36 SD1.VDD
  Top 0.406: v67.67,66.8 67.03,67.43 IC6.53 | v42.52,33.07 44.04,33.07 SD1.CARD_CONNECT_0 v54.25,26.82 | v56.39,30.33 v61.57,27.43
  Top 0.61: v39.12,33.43 39.12,42.14 36.98,44.27 35.92,44.27 35.03,45.16 35.03,52.27 30.05,57.25 v30.05,59.56 | 32.36,77.91 IC3.OUT | v35.2,75.74 29.69,70.23 29.69,64.19 30.4,63.48 v33.25,63.48 34.14,63.48 35.03,64.36 35.03,65.43 37.69,68.1 37.69,69.34 38.58,70.23 | 38.58,70.23 40.54,70.23 41.07,69.7 47.65,69.7 v48.18,70.23 | 38.58,70.23 38.58,73.43 v40.89,75.74
  Bottom 0.356: IC1.16 C3.1 57,21.64 | XB1.1 C17.1 C16.1 58.98,24.54 57,21.64 | 39.13,33.41 v39.12,33.43 | R32.2 79.72,63.14 PRG.2 77.9,64.72 75.74,64.72 73.13,66.25 68.22,66.25 v67.67,66.8 | C23.1 IC6.53 65.96,67.36 65.96,65.96 v64.36,64.36 62.64,62.64 C19.1 61.69,62.62 C20.1 | C20.1 53.13,62.62 50.42,65.32 C21.1 | v48.18,70.23 50.41,70.23 C21.1 | C20.1 53.99,61.04 v54.05,60.98 | C22.1 53.18,78.43 | v52.09,75.74 52.09,76.99 53.54,78.43 C22.1 | C21.1 50.49,69.93 | 53.61,78.49 C22.1 | R3.2 24.54,60.7 | 24.54,60.7 24.61,60.7 25.25,61.34 27.2,61.34 31.47,65.61 32.18,65.61 32.89,64.9 32.89,63.83 v33.25,63.48 | R2.2 24.54,59.61 24.54,60.7 | C2.1 53.95,14.33 v57.15,19.66 57.15,21.49 arc90 57,21.64
  Bottom 0.406: IC2.16 38.86,30.1 39.13,30.37 C8.1 v39.12,33.43 | L1.2 60.12,75.03 56.73,78.43 C22.1 | IC6.53 67.03,67.43 v67.67,66.8 | C1.1 v57.15,19.66 | 39.13,33.41 42.18,33.41 v42.52,33.07 | v54.25,26.82 v56.39,30.33 | v61.57,27.43 61.11,26.67 59.89,26.67 59.44,26.21 C16.1
  Bottom 0.61: v35.2,75.74 34.09,75.74 C14.1 | v30.05,59.56 30.05,60.27 v33.25,63.48 | v40.89,75.74 41.96,76.81 46.23,76.81 48.01,78.59 53.45,78.59 C22.1
  Bottom 0.813: IC3.OUT 33.4,77.11 C14.1
+5V  (via drill 0.6)  (2 unrouted)
  Top 0.356: R19.2 R20.2
  Top 0.61: v50.14,47.65 50.14,45.87 49.43,45.16 36.63,45.16 v36.09,45.7 | v21.34,71.96 21.34,66.85 28.63,59.56 28.63,56.72 v33.25,52.09 | JC2.4 25.93,32.92 26.31,32.54 29.69,32.54 30.58,33.43 34.14,33.43 38.23,37.52 38.23,41.07 v36.09,43.2
  Top 0.813: v65.61,36.8 R18.2 R19.2
  Bottom 0.356: C30.1 26.82,44.3 26.49,44.63 26.49,45.52 C31.1
  Bottom 0.61: v50.14,47.65 50.49,48.01 50.49,49.25 51.38,50.14 54.23,50.14 57.61,46.76 57.61,41.78 59.03,40.36 60.1,39.83 64.9,36.98 65.25,36.8 v65.61,36.8 | C15.1 21.34,74.17 v21.34,71.96 | v33.25,52.09 36.09,49.25 v36.09,45.7 v36.09,43.2 35.03,42.14 30.4,39.47 29.47,39.47 C30.1 | IC7.6 25.96,46.76 C31.1
  Bottom 0.813: C15.1 21.24,74.33 IC4.OUT
+12V  (via drill 0.6)
  Top 0.61: JC2.6 27.34,33.83 27.56,33.6 29.52,33.6 30.23,34.31 33.43,34.31 37.34,38.23 37.34,40.36 34.67,43.03 v34.67,43.38
  Top 0.813: BAT.2 49.81,48.87 46.05,52.63 36.27,52.63 v32.18,56.72 32.18,60.1 31.29,60.98 29.52,60.98 24,66.5 v23.98,66.5
  Bottom 0.61: v34.67,43.38 35.03,43.74 35.03,48.54 32.18,51.38 v32.18,56.72
  Bottom 0.813: D1.A 15.91,67.76 17.17,66.5 v23.98,66.5
/RESET_3V3
  Top 0.356: IC6.57 68.53,70.63 69.88,69.29 69.88,64.36 70.94,63.3 71.69,63.3 PRG.5
  Bottom 0.356: R32.1 77.57,60.58 75.74,61.7 73.97,61.7 PRG.5
AUDIO_PWM_3V3
  Top 0.356: R24.1 44.59,68.99 50.39,68.99 IC6.26 52.28,69.03 53.03,68.28 56.39,68.28 59.13,71.02 59.13,71.93 58.63,72.43 IC6.8
BAT_LED_3V3  (via drill 0.6)
  Top 0.356: IC6.62 67.52,74.63 68.28,75.39 v68.61,75.69 | LW_BAT.A 88.33,65.93 88.19,65.79 80.54,65.79 v79.3,67.03
  Bottom 0.356: v68.61,75.69 68.53,75.77 76.43,75.77 77.7,74.5 77.7,68.63 v79.3,67.03
COLOR_SELECT_3V3  (via drill 0.6)
  Top 0.356: IC6.16 46.21,78.03 45.7,77.52 39.65,77.52 34.85,72.72 34.85,67.74 v31.83,64.54
  Bottom 0.356: 22.73,58.19 R2.1 23.02,57.96 25.07,57.96 31.65,64.54 v31.83,64.54
  Bottom 0.406: 22.73,58.19 22.6,58.32 22.23,58.32 21.92,58.01 COLOR/START.2
ENABLE_AUDIO_OUPUT_3V3  (via drill 0.6)  (1 unrouted)
  Top 0.356: IC6.27 50.39,68.28 46.23,68.28 42.49,64.54 v41.6,64.54
  Bottom 0.356: IC7.1 19.38,52.98 19.38,54.23 21.16,56.01 24.54,56.01 26.85,58.32 32.18,58.32 38.41,64.54 v41.6,64.54
  Bottom 0.61: R38.2 19.49,50.25 19.91,50.67 IC7.1
GND  (via drill 0.6)
  Top 0.254: LA2.C 72.54,39.01 71.93,39.01 68.58,40.69 68.58,42.22 68.12,42.82 67.67,43.74 68.52,44.87
  Top 0.305: LA2.C LA1.C
  Top 0.356: 53.7,10.67 53.34,11.02 49.07,13.51 v44.45,17.63 | H2.B3,3 53.19,5.54 53.7,6.04 53.7,10.67 | 53.7,10.67 54.76,10.67 55.12,10.31 56.39,10.31 | v39.83,29.16 39.83,26.31 33.78,20.27 33.78,16 v33.43,15.65 32.72,15.65 32,16.36 24.36,29.69 24.36,30.05 v24.71,30.4 | 56.39,10.31 56.9,10.31 59.86,15.41 66.32,26.49 66.32,28.63 v65.02,29.59 65.23,28.6 R1.1 | USB.5 71.12,53.16 70.59,53.7 v70.59,54.41 | UART_C0.2 38.74,59.92 46.94,59.92 47.99,58.87 UART_E0.2 49.29,61.38 52.5,64.59 53.03,64.59 | C26.1 66.52,45.34 R33.2 68.32,45.56 v68.99,46.23 | C24.2 v75.55,72.72 | v75.55,72.72 75.55,70.41 C25.2 | v68.45,73.13 68.33,73.03 IC6.60 62.9,73.03 v62.76,72.9 | H3.B3,3 84.85,72.72 v75.55,72.72 | IC6.52 63.52,66.63 v62.76,67.39 | IC6.44 61.03,65.3 v61.52,65.79 | IC6.24 52.76,70.63 v53.52,69.88 54.05,70.41 v54.05,75.39 53.83,75.6 IC6.14 | v54.05,65.61 53.03,64.59 | 53.03,64.59 IC6.34 | 34.14,62.23 35.2,63.3 36.27,63.3 36.65,63.67 C28.1 36.83,65.1 v38.58,66.85 | JB2.1 70.81,35.38 68.45,35.38 | LA4.C LA3.C | v56.08,9.45 56.39,10.31
  Top 0.406: H1.B3,3 LB6.C 3.38,68.48 3.38,66.14 4.78,63.69 | 4.78,63.69 6.08,61.41 | 6.08,61.41 6.93,59.92 LB3.C 9.16,59.11 COLOR/START.3 | LB4.C 6.08,61.41 | LB5.C 4.78,63.69 | LA4.C 65.53,30.63 v65.02,29.59 | 68.45,35.38 LA3.C | 68.52,44.87 68.99,45.34 v68.99,46.23 | JC2.1 22.58,33.94 v22.58,44.45 | SD1.VSS 58.67,16.16 59.86,15.41 | v45.57,30.18 v42.52,30.18
  Top 0.61: UART_D0.2 43.7,46.41 v48.9,46.41 | COLOR/START.1 19.22,55.47 21.69,55.47 24.18,52.98 24.18,46.05 v22.58,44.45 19.2,47.83 18.67,47.83 17.78,49.23 C29.1
  Top 0.813: IC4.GND 20.91,75.06 C13.2 | C13.2 29.94,76.93 IC3.GND | BAT.1 52.78,51.38 49.07,51.38 46.58,53.87 v40.46,53.87 36.98,53.87 34.67,56.19 34.67,57.78 36.09,59.21 | 36.09,59.21 38.03,59.21 UART_C0.2 | 36.09,59.21 36.27,59.38 36.27,60.1 34.14,62.23 29.87,62.23 28.07,64.03 C13.2
  Bottom 0.254: 25.07,31.83 24.18,33.43
  Bottom 0.356: IC1.15 53.7,24.03 54.05,24.23 54.37,24.23 C3.2 56.54,24.23 C16.2 58.22,27.43 58.67,28.19 C17.2 59.06,29.63 58.22,30.48 46.18,37.49 45.98,37.69 XB1.10 | C12.2 40.74,27.23 | C10.2 42.91,18.34 v44.45,17.63 | H2.B3,3 42.47,5.54 | C9.2 31.27,17.8 v33.43,15.65 | C12.2 40.74,27.18 40.54,27.38 40.54,28.45 v39.83,29.16 | 38.57,26.96 C12.2 | 53.17,46.41 R16.1 T2.E 54.76,43.56 53.87,41.96 | 68.61,45.11 68.99,45.49 v68.99,46.23 | v68.99,46.23 67.92,46.94 67.92,48.54 68.63,49.25 70.05,49.25 70.59,49.78 v70.59,54.41 75.47,59.3 PRG.6 | R21.1 85.16,69 H3.B3,3 | v68.45,73.13 75.09,73.13 v75.55,72.72 | v62.76,72.9 C18.2 64.22,67.62 C23.2 | C19.2 63.48,66.1 63.48,66.5 64.33,67.36 C23.2 | v62.76,67.39 64.21,67.39 C23.2 | v61.52,65.79 61.52,64.54 C19.2 | C20.2 61.69,64.32 C19.2 | C20.2 52.12,66.18 C21.2 52.14,69.88 v53.52,69.88 | C20.2 53.99,65.55 v54.05,65.61 | C22.2 53.61,75.83 v54.05,75.39 | BAT.1 54.38,51.41 59.38,46.41 60.81,46.41 61.48,45.73 R35.1 63.31,45.87 68.63,45.87 v68.99,46.23 | COLOR/START.1 COLOR/START.3 | R38.1 22.05,48.72 23.11,48.72 23.47,48.36 IC7.7 | v22.58,44.45 22.94,44.09 23.82,44.09 C31.2 24.71,44.44 24.71,43.56 24.39,43.24 C30.2 | v24.71,30.4 25.07,30.76 25.07,31.83 | 24.18,33.43 23.18,33.43 JC2.1 | R40.1 41.25,55.12 40.46,54.33 v40.46,53.87 | C14.2 30.19,74.64 30.19,72.17 R22.1 29.86,72.11 C32.2 | T3.E 52.3,41.96 53.87,41.96 | 53.87,41.96 55.12,40.18 55.3,39.83 55.3,37.16 59.96,34.35 T1.E 61.62,33.14 R17.1 61.87,33.12 61.87,31.29 64.34,29.59 v65.02,29.59 65.08,27.13 R34.1 | C2.2 v56.08,9.45
  Bottom 0.406: 38.57,26.96 37.47,28.07 IC2.15 37.47,31.94 C8.2 | IC1.15 52.5,21.72 52.88,20.57 C11.2 55.17,18.29 55.17,17.83 53.95,15.85 53.03,15.39 52.58,14.63 51.27,12.23 v56.08,9.45 | v48.9,46.41 48.9,45.16 49.43,44.63 50.85,43.74 50.88,43.71 R15.1 T3.E | R39.1 37.73,67.7 v38.58,66.85 | R42.1 67.51,44.81 67.82,45.11 68.61,45.11 | C1.2 C2.2 | R41.1 47.23,30.18 v45.57,30.18 | v42.52,30.18 40.84,30.18 v39.83,29.16
  Bottom 0.61: BAT.1 52.3,51.41 51.92,51.03 50.14,51.03 49.07,49.96 49.07,46.58 v48.9,46.41 | IC7.7 24.89,46.05 24.89,45.34 C31.2
  Bottom 0.813: C13.2 C14.2 30.58,75.08 30.58,76.63 29.94,77.27 IC3.GND | H1.B3,3 10.75,74.3 C15.2 18.7,74.58 IC4.GND
  pour Bottom: 40.54,0 52.1,0 92.63,70.05 86.77,80.19 5.69,80.01 -0.18,69.88
  pour Top: 40.54,0 51.92,0 92.46,70.05 86.77,80.01 5.69,80.01 0,70.05
GND1  (via drill 0.6)
  Top 0.356: IC5.2 IC5.3 67.56,54.76 v68.45,55.65 | USB.M3 69.4,48.18 67.84,48.18 R33.1 | R33.1 66.85,47.34 v66.85,50.14 67.56,50.85 IC5.4 | C26.2 65.71,47.05 65.96,47.3 66.89,47.3 R33.1
  Bottom 0.356: v68.45,55.65 66.85,54.05 v66.85,50.14
  Bottom 0.406: USB.M3 USB.M4 USB.M1 USB.M2
LA1_3V3  (via drill 0.6)  (1 unrouted)
  Top 0.356: IC6.63 66.08,75.39 67.03,75.39 67.74,76.1 v67.74,76.66
  Bottom 0.254: v67.74,76.66 76.45,76.66 78.41,74.68 78.41,69.7 81.38,66.73 81.38,59.44 80.31,58.37 77.72,58.37 71.93,52.58 71.93,49.38 70.56,48.01 70.56,45.34 R5.2
LA2_3V3  (via drill 0.6)  (1 unrouted)
  Top 0.356: v66.04,77.55 66.03,77.06 IC6.64
  Bottom 0.254: v66.04,77.55 68.71,77.55 68.91,77.34 76.63,77.34 79.12,74.85 79.12,70.05 81.99,67.18 81.99,59.28 80.47,57.76 77.88,57.76 72.54,52.43 72.54,49.07 71.17,47.7 71.17,45.57 72.39,44.35 72.39,43.89 72.69,43.59 72.69,43.18 R4.2
LA3_3V3  (via drill 0.6)  (1 unrouted)
  Top 0.305: IC6.1 64.23,78.44 66.8,78.44 67.72,77.52 68.86,77.52 v69.6,78.26
  Bottom 0.254: R7.2 66.27,34.62 68.02,36.37 69.93,39.65 73.48,39.65 84.28,58.27 84.28,65.79 79.83,70.23 79.83,75.03 76.61,78.26 v69.6,78.26
LA4_3V3  (via drill 0.6)  (1 unrouted)
  Top 0.356: v68.1,78.41 67.39,79.12 63.65,79.12 63.43,78.9 IC6.2
  Bottom 0.254: 69.65,35.23 71.83,38.94 73.64,38.94 84.99,58.55 84.99,65.96 80.54,70.41 80.54,75.21 76.63,79.12 68.81,79.12 v68.1,78.41
  Bottom 0.305: 69.65,35.23 R6.2
LB3_3V3  (via drill 0.6)
  Top 0.356: IC6.9 57.83,71.7 v57.78,71.65
  Bottom 0.356: R8.2 16.49,62.76 26.85,62.76 31.11,67.03 33.6,67.03 39.12,72.54 42.14,72.54 43.2,73.61 48.18,73.61 50.14,71.65 v57.78,71.65
LB4_3V3  (via drill 0.6)
  Top 0.356: v56.72,72.54 57.03,72.86 IC6.10
  Bottom 0.356: R9.2 14.14,63.48 26.67,63.48 30.94,67.74 33.43,67.74 38.94,73.25 41.96,73.25 42.49,73.79 43.03,74.32 48.36,74.32 48.9,73.79 50.32,72.36 56.54,72.36 v56.72,72.54
LB5_3V3  (via drill 0.6)
  Top 0.356: v55.65,73.43 56.23,74.01 IC6.11
  Bottom 0.356: R10.2 12.64,65.79 14.38,65.79 15.98,64.19 26.49,64.19 30.76,68.45 33.25,68.45 38.76,73.97 41.78,73.97 42.32,74.5 42.85,75.03 43.2,75.03 48.54,75.03 49.07,74.5 50.49,73.08 55.3,73.08 v55.65,73.43
LB6_3V3  (via drill 0.6)
  Top 0.356: v55.3,74.68 55.43,74.81 IC6.12
  Bottom 0.356: R11.2 14.21,67.74 14.25,67.74 17.09,64.9 26.31,64.9 30.58,69.16 33.07,69.16 38.58,74.68 41.6,74.68 42.14,75.21 42.67,75.74 48.9,75.74 49.43,75.21 50.85,73.79 54.59,73.79 55.3,74.5 v55.3,74.68
LED_BLUE_3V3  (via drill 0.6)  (1 unrouted)
  Top 0.254: 66.5,37.69 68.1,40.54 68.07,41.73 v67.18,42.62 | v61.09,76 61.09,77.98 IC6.5
  Top 0.356: v64.19,30.94 66.85,35.38 66.5,37.69
  Bottom 0.254: v61.09,76 61.62,76.53 66.4,76.53 68.3,74.62 68.78,74.62 69.29,75.13 75.97,75.13 77.01,74.09 77.01,67.97 80.77,64.21 80.77,59.59 80.16,58.98 77.57,58.98 71.32,52.73 71.32,49.53 69.95,48.16 69.95,45.57 68.89,44.5 68.43,44.5 67.18,43.26 v67.18,42.62
  Bottom 0.356: v64.19,30.94 63.32,31.8 R17.2 R12.1
LED_GREEN_3V3  (via drill 0.6)
  Top 0.254: IC6.55 67.54,69.03 67.94,68.63 68.94,68.63 69.37,68.2 69.37,63.98 79.55,53.8 v80.16,53.95
  Bottom 0.254: R16.2 51.88,47.65 54.41,47.65 56.9,45.16 56.9,41.43 58.67,39.65 60.27,38.76 65.61,35.74 66.14,35.74 66.67,36.27 66.5,37.69 68.1,40.54 68.22,40.62 68.99,40.62 69.49,40.11 73.2,40.11 80.65,52.93 80.65,53.46 v80.16,53.95
  Bottom 0.356: R13.1 R16.2
LED_RED_3V3  (via drill 0.6)
  Top 0.254: 64.54,38.33 66.52,41.76 66.52,41.94 63.83,44.63 63.83,51.03 65.08,52.27 65.08,54.76 65.79,55.47 65.79,57.61 62.59,60.81 62.59,62.38 IC6.46
  Top 0.356: v52.27,38.76 52.27,39.47 54.59,41.78 57.96,41.78 63.98,38.33 64.54,38.33
  Bottom 0.356: v52.27,38.76 51.03,38.76 48.9,40.01 48.29,40.61 R14.1 R15.2
N$1  (via drill 0.6)  (1 unrouted)
  Top 0.305: LA2.A 70.56,41.15 69.95,41.15 v69.6,41.5
  Bottom 0.254: 69.49,41.45 v69.6,41.5 69.6,41.43 72.19,41.43 72.19,41.45 R4.1
N$2  (via drill 0.6)  (1 unrouted)
  Top 0.305: v68.76,43.54 69.04,43.43 69.38,43.78 71.35,43.78 LA1.A
  Bottom 0.254: v68.76,43.54 69.34,42.67 69.49,42.67 69.67,42.85 R5.1
N$3  (via drill 0.6)
  Top 0.406: LB3.A 10.33,60.81 11.2,60.81 v11.73,61.34
  Bottom 0.406: v11.73,61.34 11.94,61.54 R8.1
N$4  (via drill 0.6)
  Top 0.305: v70.1,34.14 69.8,33.83 LA3.A
  Bottom 0.305: R7.1 65.99,31.62 65.99,28.8 66.45,28.35 67.36,28.35 70.1,33.38 v70.1,34.14
N$5  (via drill 0.6)
  Top 0.406: LB4.A 9.19,63.12 9.78,63.12 10.31,63.65 v10.49,63.65
  Bottom 0.406: v10.49,63.65 10.51,63.68 R9.1
N$6  (via drill 0.6)
  Top 0.406: LB5.A 7.88,65.43 8.89,65.43 v9.25,65.79
  Bottom 0.406: v9.25,65.79 9.27,65.81 R10.1
N$7  (via drill 0.6)
  Top 0.406: LB6.A 4.95,66.67 v6.58,66.67
  Bottom 0.406: v6.58,66.67 6.93,67.03 9.96,67.03 10.82,67.9 R11.1
N$8  (via drill 0.6)
  Top 0.305: v66.9,29.57 LA4.A
  Bottom 0.305: R6.1 66.75,30.18 v66.9,29.57
N$9  (1 unrouted)
  Bottom 0.61: HP.5 19.38,42.53 20.09,44.81 IC7.8
N$15  (via drill 0.6)
  Top 0.61: C29.2 21.35,52.46 21.51,52.63 21.51,52.98 v20.62,53.87
  Bottom 0.61: IC7.3 22.05,53.02 22.05,53.34 21.51,53.87 v20.62,53.87 arc43 20.8,52.98 IC7.2
N$18
  Bottom 0.406: IC2.6 32.38,21.8 C9.1
N$20  (via drill 0.6)
  Top 0.356: R24.2 39.98,66.08 C28.2 39.45,62.21 v39.29,61.87
  Bottom 0.356: v39.29,61.87 36.8,61.87 32.54,57.61 31.11,57.61 30.76,57.25 30.76,54.59 29.87,53.87 C27.1
N$22  (via drill 0.6)  (1 unrouted)
  Top 0.356: v53.52,38.41 54.41,38.05 LED1.3
  Bottom 0.356: T3.C 54.08,39.5 v53.52,38.41
N$23  (via drill 0.6)  (2 unrouted)
  Top 0.356: v55.83,40.89 55.12,40.18 55.12,38.76 55.47,38.41 55.73,38.41 LED1.2
  Bottom 0.356: T2.C 55.12,41.96 v55.83,40.89
N$24  (via drill 0.6)
  Top 0.356: LED1.1 56.36,39.12 v56.9,40.01
  Bottom 0.356: v56.9,40.01 56.9,38.47 T1.C
N$25
  Bottom 0.406: C12.1 38.59,25.26 37.47,24.13 IC2.2
N$26
  Bottom 0.406: IC1.2 50.98,19.43 51.36,19.43 C11.1
N$27  (1 unrouted)
  Bottom 0.356: R14.2 T3.B
N$28
  Bottom 0.356: IC1.1 50.49,16.2 50.46,16.17 C4.1
N$29
  Bottom 0.406: IC2.1 38.73,20.74 C6.1
N$30
  Bottom 0.356: C5.1 46.94,16.02 46.94,17.63 IC1.4
N$31
  Bottom 0.356: C5.2 45.52,16.82 45.52,17.63 IC1.5
N$32
  Bottom 0.356: C4.2 48.72,15.05 48.72,17.98 48.91,18.18 IC1.3
N$33
  Bottom 0.406: IC2.3 36.2,21.72 36.58,21.34 36.58,20.87 C6.2
N$34
  Bottom 0.356: IC2.4 34.85,23.14 34.85,21.34 33.78,20.27 33.78,19.2 34.78,18.2 C7.1
N$35
  Bottom 0.356: IC2.5 33.66,21.57 33.08,20.99 C7.2
N$36  (2 unrouted)
  Bottom 0.61: R25.1 26.31,54.76 C27.2
N$37  (1 unrouted)
  Bottom 0.61: IC7.4 23.82,53.16 R25.2 25.07,53.87 25.6,52.81 R37.1
N$38
  Bottom 0.61: R37.2 25.96,50.05 25.96,49.43 IC7.5 27.25,47.65 28.09,47.65 29.31,48.87 HP.3 30.39,46.42 31.11,45.7 31.11,43.47 HP.4
N$52  (1 unrouted)
  Bottom 0.356: R13.2 T2.B
N$53
  Bottom 0.356: T1.B R12.2
N$57  (1 unrouted)
  Top 0.356: LED1.6 59.11,37.34 60.1,37.34 60.57,37.81 R18.1
N$58  (1 unrouted)
  Top 0.356: LED1.5 59.38,36.27 60.92,36.27 R19.1
N$59  (1 unrouted)
  Top 0.356: LED1.4 59.38,35.2 59.38,34.76 R20.1
N$60  (via drill 0.6)  (2 unrouted)
  Top 0.356: v89.97,69.7 89.68,69.41 LW_BAT.C
  Bottom 0.356: R21.2 89.97,68.63 v89.97,69.7
N$62
  Bottom 0.356: R23.2 21.08,68.68 20.57,69.19 20.57,69.28 D1.C
  Bottom 0.813: IC4.IN 17.66,78.77 22.76,78.77 25.27,76.25 C13.1 | C13.1 25.27,75.9 IC3.IN | C13.1 23.57,73.35 23.57,72.18 21.34,69.95 D1.C
N$71  (via drill 0.6)
  Top 0.356: v69.39,74.02 67.97,74.02 67.79,73.83 IC6.61
  Bottom 0.356: L1.1 66.81,74.14 66.81,73.97 | 66.81,73.97 66.81,73.79 C18.1 | v69.39,74.02 68,74.02 67.92,73.97 66.81,73.97
N$75
  Top 0.356: IC6.59 69.03,72.23 71.48,74.68 71.48,76.37 Q1.1 75.28,76.53 C24.1
N$76
  Top 0.356: C25.1 73.86,66.88 Q1.2 71.3,67.22 71.3,68.99 68.85,71.43 IC6.58
PDI_3V3  (via drill 0.6)
  Top 0.356: IC6.56 68.06,69.83 v68.2,69.7
  Bottom 0.356: v68.2,69.7 72.22,69.7 PRG.1
PROP_IRQ_0_3V3
  Top 0.254: 60.63,41.67 60.45,41.78 60.45,43.38 60.98,44.09 60.98,51.03 62.94,52.98 62.94,55.47 63.65,56.19 63.65,56.9 61.52,59.03 60.1,59.03 57.83,61.29 IC6.40
  Top 0.356: JB2.13 60.63,41.67
PROP_IRQ_1_3V3
  Top 0.254: IC6.41 58.63,61.38 60.27,59.74 61.52,59.74 64.19,57.07 64.19,56.01 63.48,55.3 63.48,52.81 61.67,51 JB2.14
RX_C0_3V3  (via drill 0.6)
  Top 0.356: IC6.18 44.67,75.43 v40.72,71.48
  Bottom 0.356: IC2.9 29.56,29.08 R28.2 28.09,29.31 28.09,30.58 32.36,34.85 32.72,34.85 38.05,38.05 38.05,56.62 40.89,59.46 40.89,62.23 42.67,64.01 42.67,64.9 39.43,68.14 R39.2 | 39.43,69.3 R39.2 | R39.2 39.47,69.16 39.47,70.23 v40.72,71.48
  Bottom 0.406: IC2.9 29.84,28.7
RX_C0_232  (via drill 0.6)
  Top 0.356: 36.98,56.72 37.06,56.8 v36.63,56.8 UART_C0.4
  Bottom 0.356: 29.87,23.24 IC2.8 29.74,23.11 29.16,23.11 27.38,24.89 27.38,26.31 27.86,26.8 R28.1 27.03,27.38 26.31,28.09 26.31,29.87 32,35.56 32.36,35.56 37.34,38.41 37.34,56.08 36.73,56.69 v36.63,56.8
  Bottom 0.406: IC2.8 29.84,23.62
RX_D0_3V3  (via drill 0.6)
  Top 0.356: v43.2,63.12 47.52,67.43 IC6.28
  Bottom 0.356: R27.2 33.66,32.24 34.14,32.72 34.14,33.07 40.18,36.98 40.18,47.65 41.25,48.72 41.25,51.38 43.2,53.34 43.2,55.47 | R40.2 42.99,55.26 43.2,55.47 | 43.2,55.47 43.89,56.16 43.89,62.43 v43.2,63.12
  Bottom 0.406: R27.2 IC2.12
RX_D0_232  (via drill 0.6)
  Top 0.356: v42.32,49.07 42.33,49.06 UART_D0.4
  Bottom 0.356: R27.1 35.36,32.87 35.56,33.07 40.89,36.63 40.89,47.3 41.96,48.36 41.96,48.72 v42.32,49.07
  Bottom 0.406: IC2.13 34.92,30.73 35.43,31.24 35.43,31.89 R27.1
RX_E0_3V3  (via drill 0.6)  (1 unrouted)
  Top 0.356: IC6.38 56.23,61.11 59.03,58.32 59.03,56.01 58.67,55.65 v58.67,54.41
  Bottom 0.305: R26.2 IC1.12
  Bottom 0.356: R26.2 51.24,29.29 | v58.67,54.41 51.03,54.41 50.67,54.76 49.78,54.76 46.05,51.03 46.05,48.18 43.74,45.87 43.74,35.92 44.81,34.9 51.24,30.29 51.24,29.29 | R41.2 51.23,29.91 51.24,29.29
RX_E0_232  (via drill 0.6)
  Top 0.356: UART_E0.4 49.29,54.55 v50.14,53.7
  Bottom 0.305: 52.65,26.89 51.82,26.06 IC1.13
  Bottom 0.356: 52.65,26.89 R26.1 52.71,30.29 44.45,36.27 44.45,45.52 46.76,47.83 46.76,50.67 49.78,53.7 v50.14,53.7
RX_PROP_3V3
  Top 0.254: JB2.12 62.76,43.01 62.76,43.92 62.41,44.27 62.41,51.03 64.01,52.63 64.01,55.12 64.72,55.83 64.72,57.25 61.52,60.45 60.45,60.45 59.43,61.47 IC6.42
  Bottom 0.356: JB2.12 64.76,43.72 R42.2
SD_CONNECTED_3V3  (via drill 0.6)  (1 unrouted)
  Top 0.356: R1.2 63.3,30.05 62.59,30.76 52.45,36.63 51.21,37.34 51.21,39.29 54.41,42.49 56.01,42.49 60.45,46.94 60.45,51.38 62.23,53.16 62.23,56.19 v62.59,56.54 | v47.47,65.08 48.23,65.83 IC6.30
  Top 0.406: R1.2 62.18,26.21 62.18,24.38 SD1.CARD_CONNECT_1
  Bottom 0.356: v62.59,56.54 62.59,57.96 60.98,59.56 57.07,59.56 56.19,58.67 52.09,58.67 48.18,62.59 48.18,64.36 v47.47,65.08
SD_CS_3V3  (via drill 0.6)
  Top 0.356: IC6.54 67.56,68.23 68.73,67.06 68.73,63.86 72.77,59.82 72.77,58.42 v72.03,57.68 | SD1.CD/DAT3 59.12,21.01 v59.13,22.25 57.76,23.62 57.76,28.19 44.65,36.27 44.65,39.32 45.41,40.08 50.93,40.08 54.05,43.2 55.83,43.2 59.56,46.94 v59.56,47.65
  Bottom 0.356: v59.56,47.65 61.34,50.14 68.1,56.9 71.25,56.9 v72.03,57.68
  Bottom 0.406: R34.2 62.18,22.25 v59.13,22.25
SD_MISO_3V3  (via drill 0.6)
  Top 0.356: SD1.DAT0 55.32,16.92 55.32,27.43 42.67,35.2 42.67,40.54 44.5,42.37 50.55,42.37 53.52,45.34 55.12,45.34 57.25,47.47 57.25,48.54 58.32,49.61 58.32,52.45 v59.92,54.05 | v43.74,71.48 44.09,71.83 45.34,71.83 45.7,71.48 46.76,71.48 47.47,72.19 50.39,72.19 IC6.22
  Bottom 0.356: v59.92,54.05 60.81,54.94 60.81,55.63 59,57.43 57.61,57.43 56.72,56.54 51.56,56.54 46.05,62.05 46.05,63.3 43.56,65.79 43.56,71.3 v43.74,71.48
SD_MOSI_3V3  (via drill 0.6)
  Top 0.356: SD1.CMD 57,21.03 57,27.89 44.04,35.81 44.04,39.78 45.11,40.84 50.8,40.84 53.87,43.92 55.65,43.92 58.67,46.94 58.67,48.18 59.74,49.25 59.74,51.56 61.52,53.34 61.52,56.19 61.7,56.36 61.7,57.43 v60.98,58.14 | IC6.21 46.9,73.03 v46.23,72.36
  Bottom 0.356: v60.98,58.14 60.27,58.85 57.25,58.85 56.36,57.96 51.92,57.96 47.47,62.41 47.47,63.65 46.05,65.08 46.05,72.19 v46.23,72.36
SD_SCLK_3V3  (via drill 0.6)
  Top 0.356: IC6.23 47.78,71.43 46.94,70.59 45.34,70.59 v44.98,70.76 | v60.81,56.9 60.81,53.52 59.03,51.74 59.03,49.43 57.96,48.36 57.96,47.12 55.47,44.63 53.7,44.63 50.67,41.6 44.81,41.6 43.43,40.23 43.43,35.51 56.24,27.58 56.24,18.9 SD1.CLK
  Bottom 0.356: v60.81,56.9 59.56,58.14 57.43,58.14 56.54,57.25 51.74,57.25 46.76,62.23 46.76,63.48 44.98,65.25 v44.98,70.76
STARTING_CORD_3V3  (via drill 0.6)
  Top 0.356: IC6.17 49.47,76.23 48.9,76.81 39.83,76.81 35.56,72.54 35.56,67.03 v33.78,65.25
  Bottom 0.356: R3.1 21.84,61.14 22.76,62.05 27.03,62.05 31.29,66.32 32.72,66.32 v33.78,65.25
  Bottom 0.406: R3.1 21.41,60.03 21.34,60.1 19.79,60.1 COLOR/START.4
TX_C0_3V3  (via drill 0.6)
  Top 0.356: v58.14,56.54 57.78,56.19 57.78,54.23 57.25,53.7 55.83,53.7 54.94,52.81 54.94,47.83 54.59,47.47 52.98,47.47 49.96,44.45 43.38,44.45 40.18,41.25 40.18,31.29 39.47,30.58 31.65,30.58 31.24,30.17 R29.2 31.24,26.67 v31.39,26.52 | IC6.19 45.3,74.63 v42.14,71.48
  Bottom 0.356: v58.14,56.54 57.43,55.83 51.38,55.83 45.34,61.87 45.34,63.12 41.25,67.21 41.25,70.59 v42.14,71.48 | v31.39,26.52 31.11,26.8 IC2.10
TX_C0_232  (via drill 0.6)
  Top 0.356: v31.29,31.65 29.52,29.87 29.52,28.77 R29.1 29.54,26.55 v29.72,26.36 | UART_C0.1 43.82,58.14 44.45,58.14 44.38,58.07 UART_C0.1 | v42.14,58.07 UART_C0.1
  Bottom 0.356: v31.29,31.65 31.11,31.65 31.11,32.54 32.72,34.14 33.07,34.14 38.76,37.69 38.76,56.29 39.01,56.54 40.54,58.07 v42.14,58.07 | v29.72,26.36 31.11,24.97 IC2.7
TX_D0_3V3  (via drill 0.6)
  Top 0.356: IC6.29 47.61,66.63 44.27,63.3 44.27,62.1 43.56,61.39 v42.14,61.39 | R30.2 33.07,29.05 v33.07,26.67
  Bottom 0.356: v33.07,26.67 32.38,27.36 IC2.11 32.38,32.38 33.68,33.68 39.47,37.34 39.47,55.17 40.84,56.54 42.22,56.54 43.13,57.45 43.13,60.4 v42.14,61.39
TX_D0_232  (via drill 0.6)
  Top 0.356: UART_D0.1 39.08,47.79 39.47,48.18 39.83,48.18 40.72,49.07 40.72,50.32 41.45,51.05 41.91,51.05 v42.34,51.03 | R30.1 35.13,28.99 v35.13,26.52
  Bottom 0.356: v35.13,26.52 36.2,27.58 IC2.14 36.2,30.86 36.42,31.09 36.42,32.77 36.58,32.92 41.6,36.27 41.6,46.94 43.43,48.77 43.43,49.99 42.34,51.08 v42.34,51.03
TX_E0_3V3  (via drill 0.6)  (1 unrouted)
  Top 0.356: v59.74,55.3 59.74,58.5 57.03,61.2 IC6.39
  Bottom 0.356: v59.74,55.3 59.38,55.47 57.96,55.47 57.61,55.12 51.21,55.12 50.85,55.47 49.53,55.47 45.41,51.36 45.41,48.62 42.98,46.18 42.98,35.66 44.2,34.44 44.2,28.04 43.74,27.58 43.74,27.17 R31.2 46.18,25.15 46.63,25.15 IC1.10 IC1.11
TX_E0_232  (via drill 0.6)
  Top 0.356: UART_E0.1 46.93,57.6 46.48,57.15 46.48,55.32 47.04,54.76 v47.45,54.76
  Bottom 0.356: IC1.7 44.81,21.64 44.81,24.08 R31.1 42.22,25.76 42.22,27.28 43.43,28.5 43.43,34.14 42.22,35.36 42.22,46.48 44.81,49.07 44.81,52.12 v47.45,54.76
TX_PROP_3V3
  Top 0.254: JB2.11 63.39,40.63 63.83,41.07 64.54,42.32 64.54,43.03 63.12,44.45 63.12,51.03 64.54,52.45 64.54,54.94 65.25,55.65 65.25,57.43 61.52,61.16 60.63,61.16 60.23,61.56 IC6.43
USB_5V  (via drill 0.6)
  Top 0.356: USB.1 69.88,50.14 v68.45,50.14 68.51,50.2 IC5.5
  Bottom 0.356: v68.45,50.14 68.28,50.14 67.21,49.07 66.87,49.07 R36.2
USB_CONNECTED_3V3  (via drill 0.6)
  Top 0.254: IC6.47 63.43,60.67 66.5,57.61 66.5,55.47 66.14,55.12 66.14,51.21 65.79,50.85 65.79,49.43 v64.9,48.54
  Bottom 0.356: R36.1 66.43,46.94 65.43,46.94 64.9,47.47 v64.9,48.54 63.92,48.54 R35.2
USB_DATA+  (via drill 0.6)  (1 unrouted)
  Top 0.356: USB.3 70.23,51.74 70.23,52.98 69.46,53.76 IC5.1 69.52,54.3 69.52,54.69 69.6,54.76 v69.6,59.38 | IC6.33 52.27,62.39 52.27,59.92 v52.45,59.74
  Bottom 0.356: v69.6,59.38 68.53,60.45 57.07,60.45 56.01,59.38 52.81,59.38 v52.45,59.74
USB_DATA-  (via drill 0.6)
  Top 0.356: USB.2 69.7,51.21 69.52,51.38 IC5.6 69.46,52.51 68.99,52.98 67.39,52.98 66.85,53.52 66.85,54.94 67.21,55.3 67.21,56.01 68.68,57.48 68.68,60.2 v67.06,61.52 | IC6.32 50.36,64.23 49.43,63.3 v49.43,62.94
  Bottom 0.356: v67.06,61.52 66.7,61.16 56.9,61.16 55.83,60.1 53.52,60.1 52.45,61.16 51.21,61.16 v49.43,62.94
V-
  Bottom 0.356: IC1.6 44.81,19.41 42.67,19.41 C10.1 41.45,18.75 41.6,19.36 41.91,19.96 42.67,20.57 IC1.8
VBAT_0_1V  (via drill 0.6)
  Top 0.356: v45.52,78.77 45.87,79.12 54.23,79.12 54.63,78.72 IC6.13
  Bottom 0.356: v45.52,78.77 40.36,78.77 33.57,71.97 R22.2 31.65,71.72 31.65,70.76 30.87,69.98 29.29,69.98 28.62,69.31 C32.1 26.5,68.68 R23.1
XBEE_CTS_3V3  (via drill 0.6)
  Top 0.356: XB1.12 40.54,22.69 40.54,28.09 40.89,28.45 40.89,40.89 43.74,43.74 50.14,43.74 53.16,46.76 54.76,46.76 55.65,47.65 55.65,51.92 v55.83,52.09 | IC6.50 66.89,65.03 67.44,64.49 67.44,63.07 68.86,61.65 v68.71,61.57
  Bottom 0.356: v68.71,61.57 68.86,61.57 70.64,59.79 70.64,58.85 70.1,58.32 67.74,58.32 61.16,51.74 58.14,51.74 57.61,52.27 56.01,52.27 v55.83,52.09
XBEE_RTS_3V3  (via drill 0.6)
  Top 0.356: XB1.16 43.64,16.1 42.67,17.07 40.89,18.14 40.54,18.49 40.54,21.69 41.25,22.4 41.25,27.74 41.6,28.09 41.6,40.54 44.09,43.03 50.32,43.03 53.34,46.05 54.94,46.05 56.36,47.47 56.36,50.85 v56.9,51.38 | IC6.51 66.08,65.79 67.03,65.79 68.15,64.67 68.15,63.55 71.55,60.15 v71.55,59.28
  Bottom 0.356: v71.55,59.28 71.55,58.57 70.59,57.61 67.92,57.61 61.34,51.03 57.96,51.03 57.61,51.38 v56.9,51.38
XBEE_RX_3V3  (via drill 0.6)
  Top 0.356: v66.57,58.85 64.19,61.21 64.19,62.56 IC6.48
  Bottom 0.356: XB1.2 59.84,31.91 58.32,33.96 46.76,40.54 46.23,41.25 46.23,45.16 48.18,47.12 48.18,50.32 49.78,51.92 50.85,51.92 51.92,52.98 57.78,52.98 58.32,52.45 60.98,52.45 64.36,55.83 64.36,58.14 65.08,58.85 v66.57,58.85 65.96,58.85
XBEE_TX_3V3  (via drill 0.6)
  Top 0.356: IC6.49 66.08,64.19 66.08,61.1 v67.64,59.56
  Bottom 0.356: XB1.3 58.1,32.93 57.25,33.78 46.23,40.18 45.52,40.89 45.52,45.52 47.47,47.47 47.47,50.49 49.61,52.63 50.49,52.63 51.56,53.7 57.96,53.7 58.5,53.16 60.81,53.16 63.65,56.01 63.65,58.32 65.08,59.74 67.46,59.74 v67.64,59.56

### Text on the board
tPlace: - | + | Sab'Otter V2 | 2014